# EAGLE schematic FLYTE_3.0 (EAGLE 9.6.2)
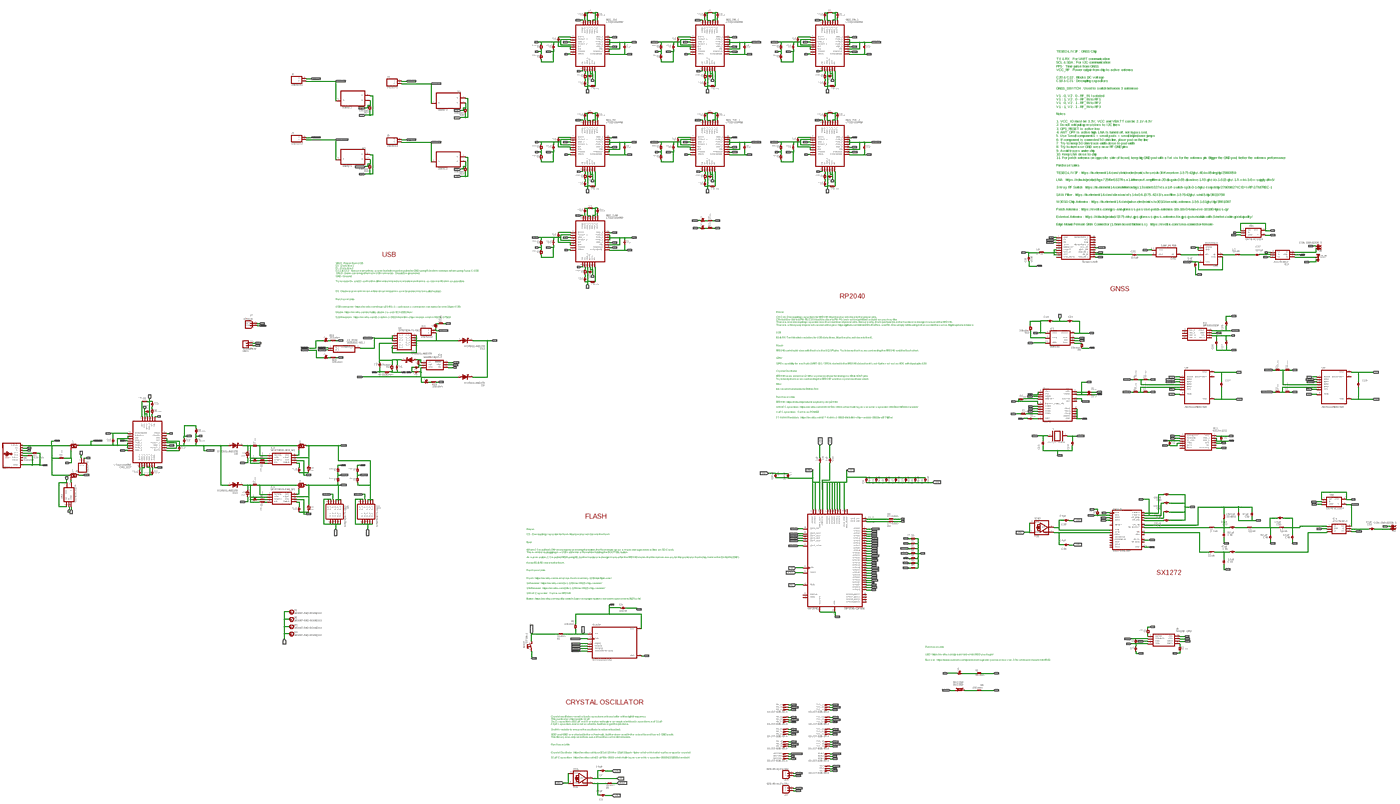
[diagram p0: schematic, sheet 1, overview]
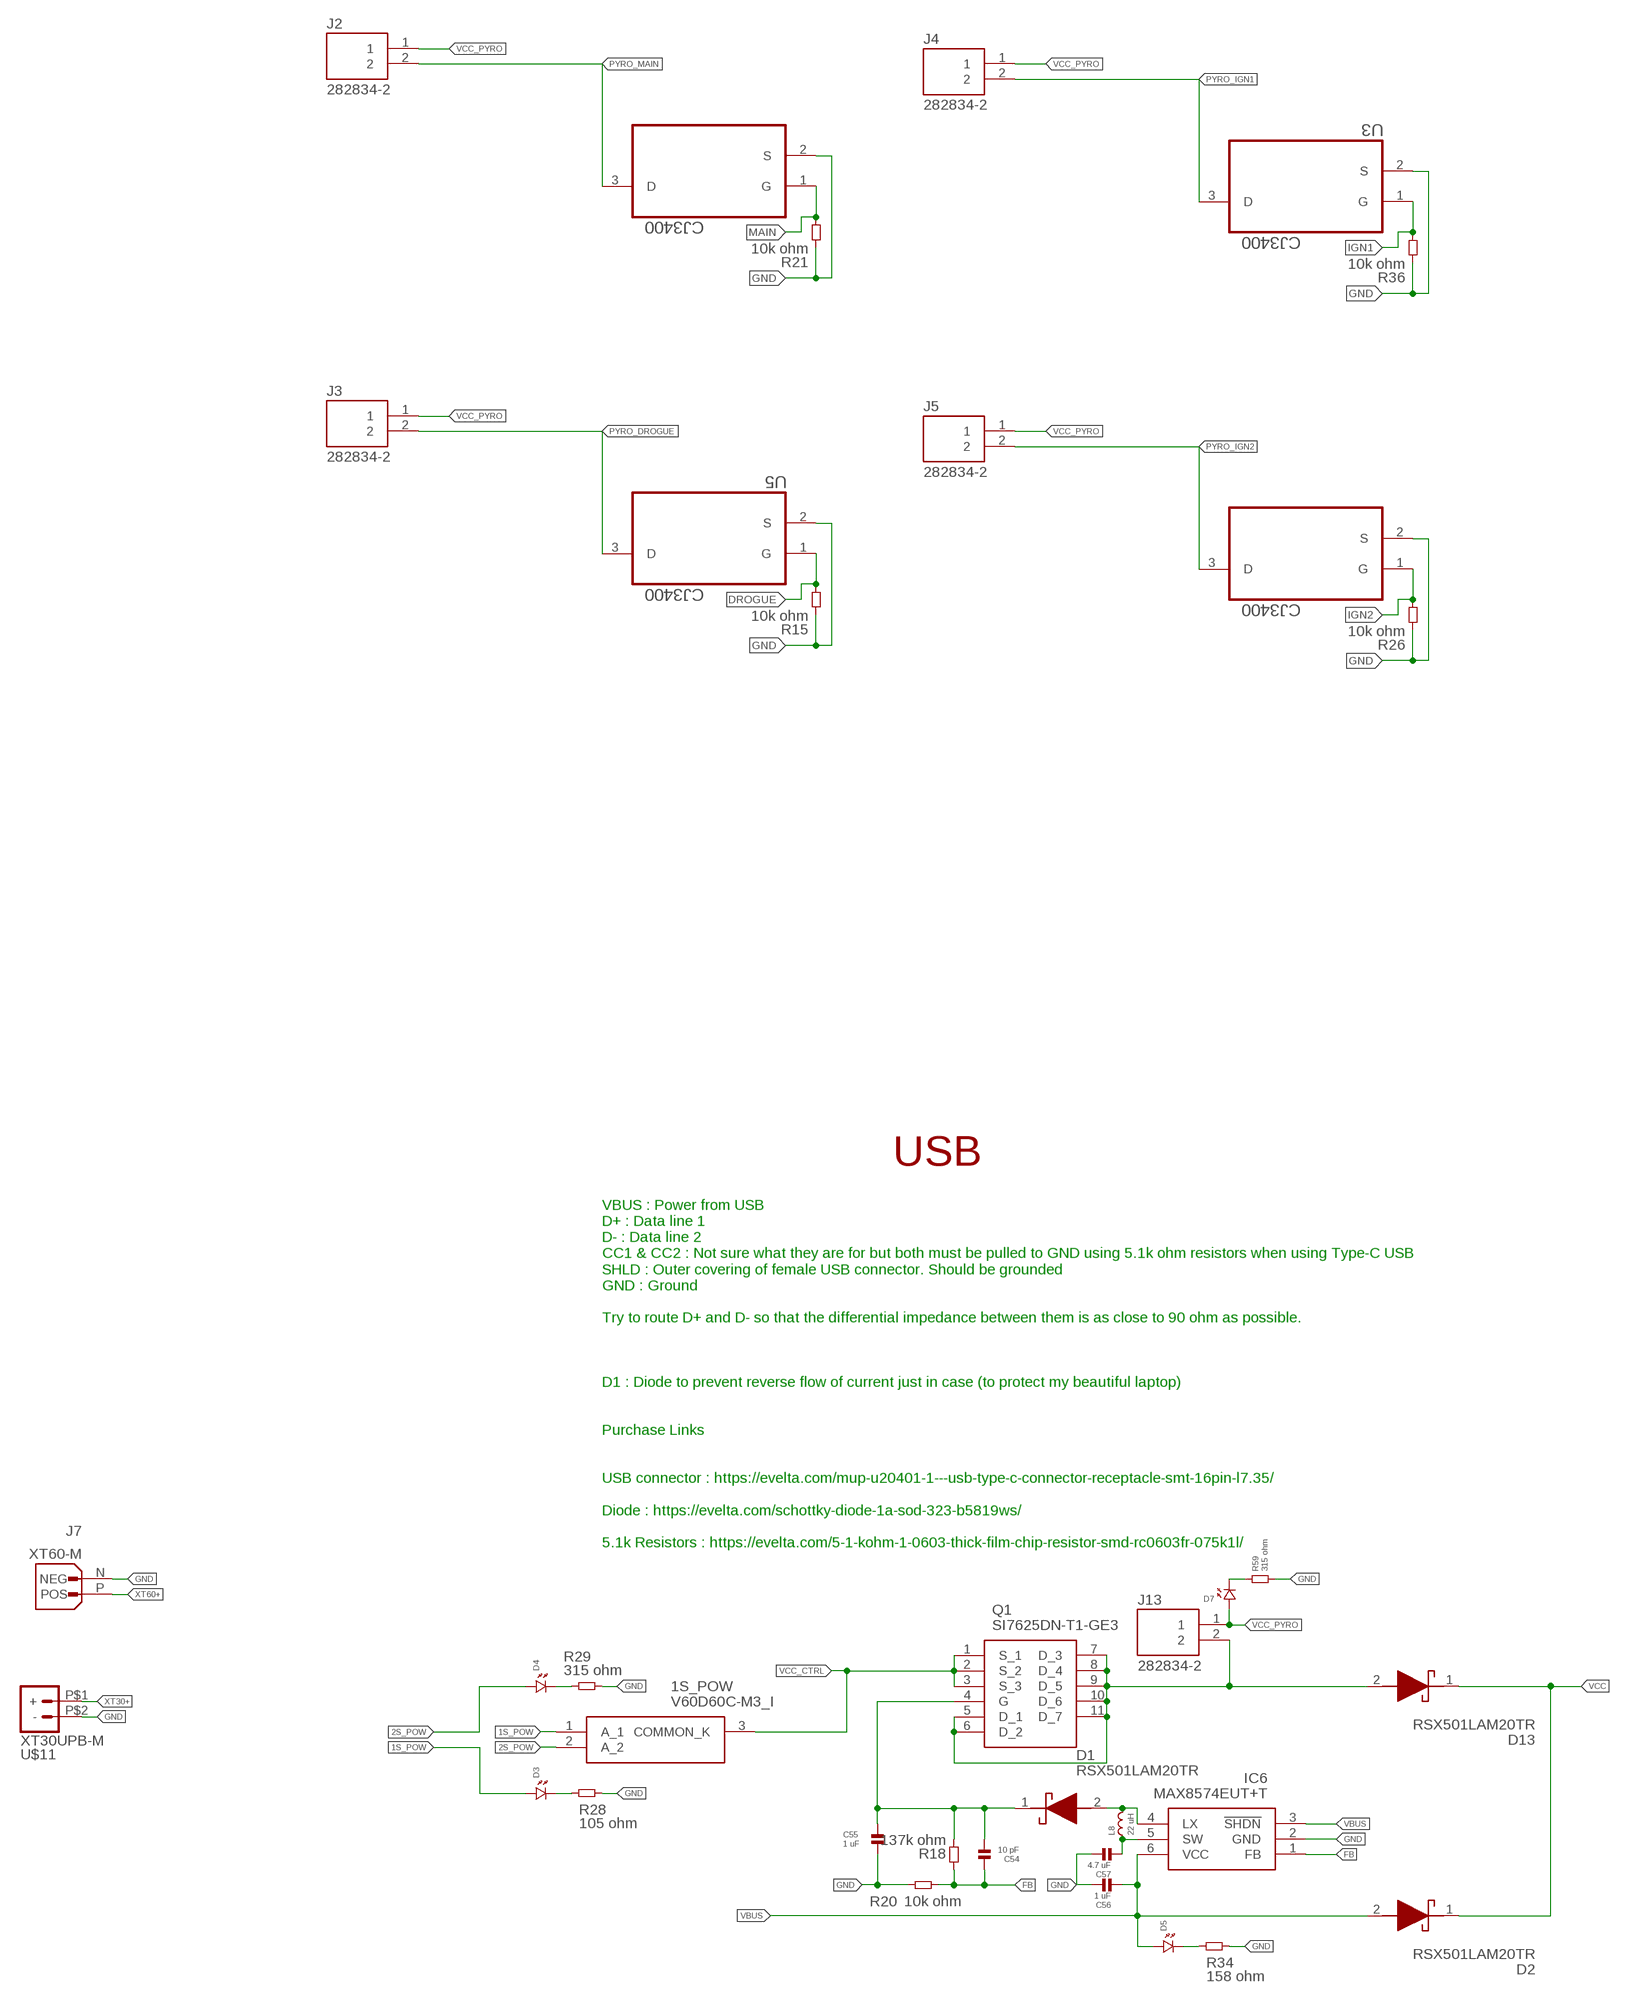
[diagram p1: schematic, sheet 1, part 1 of 6]
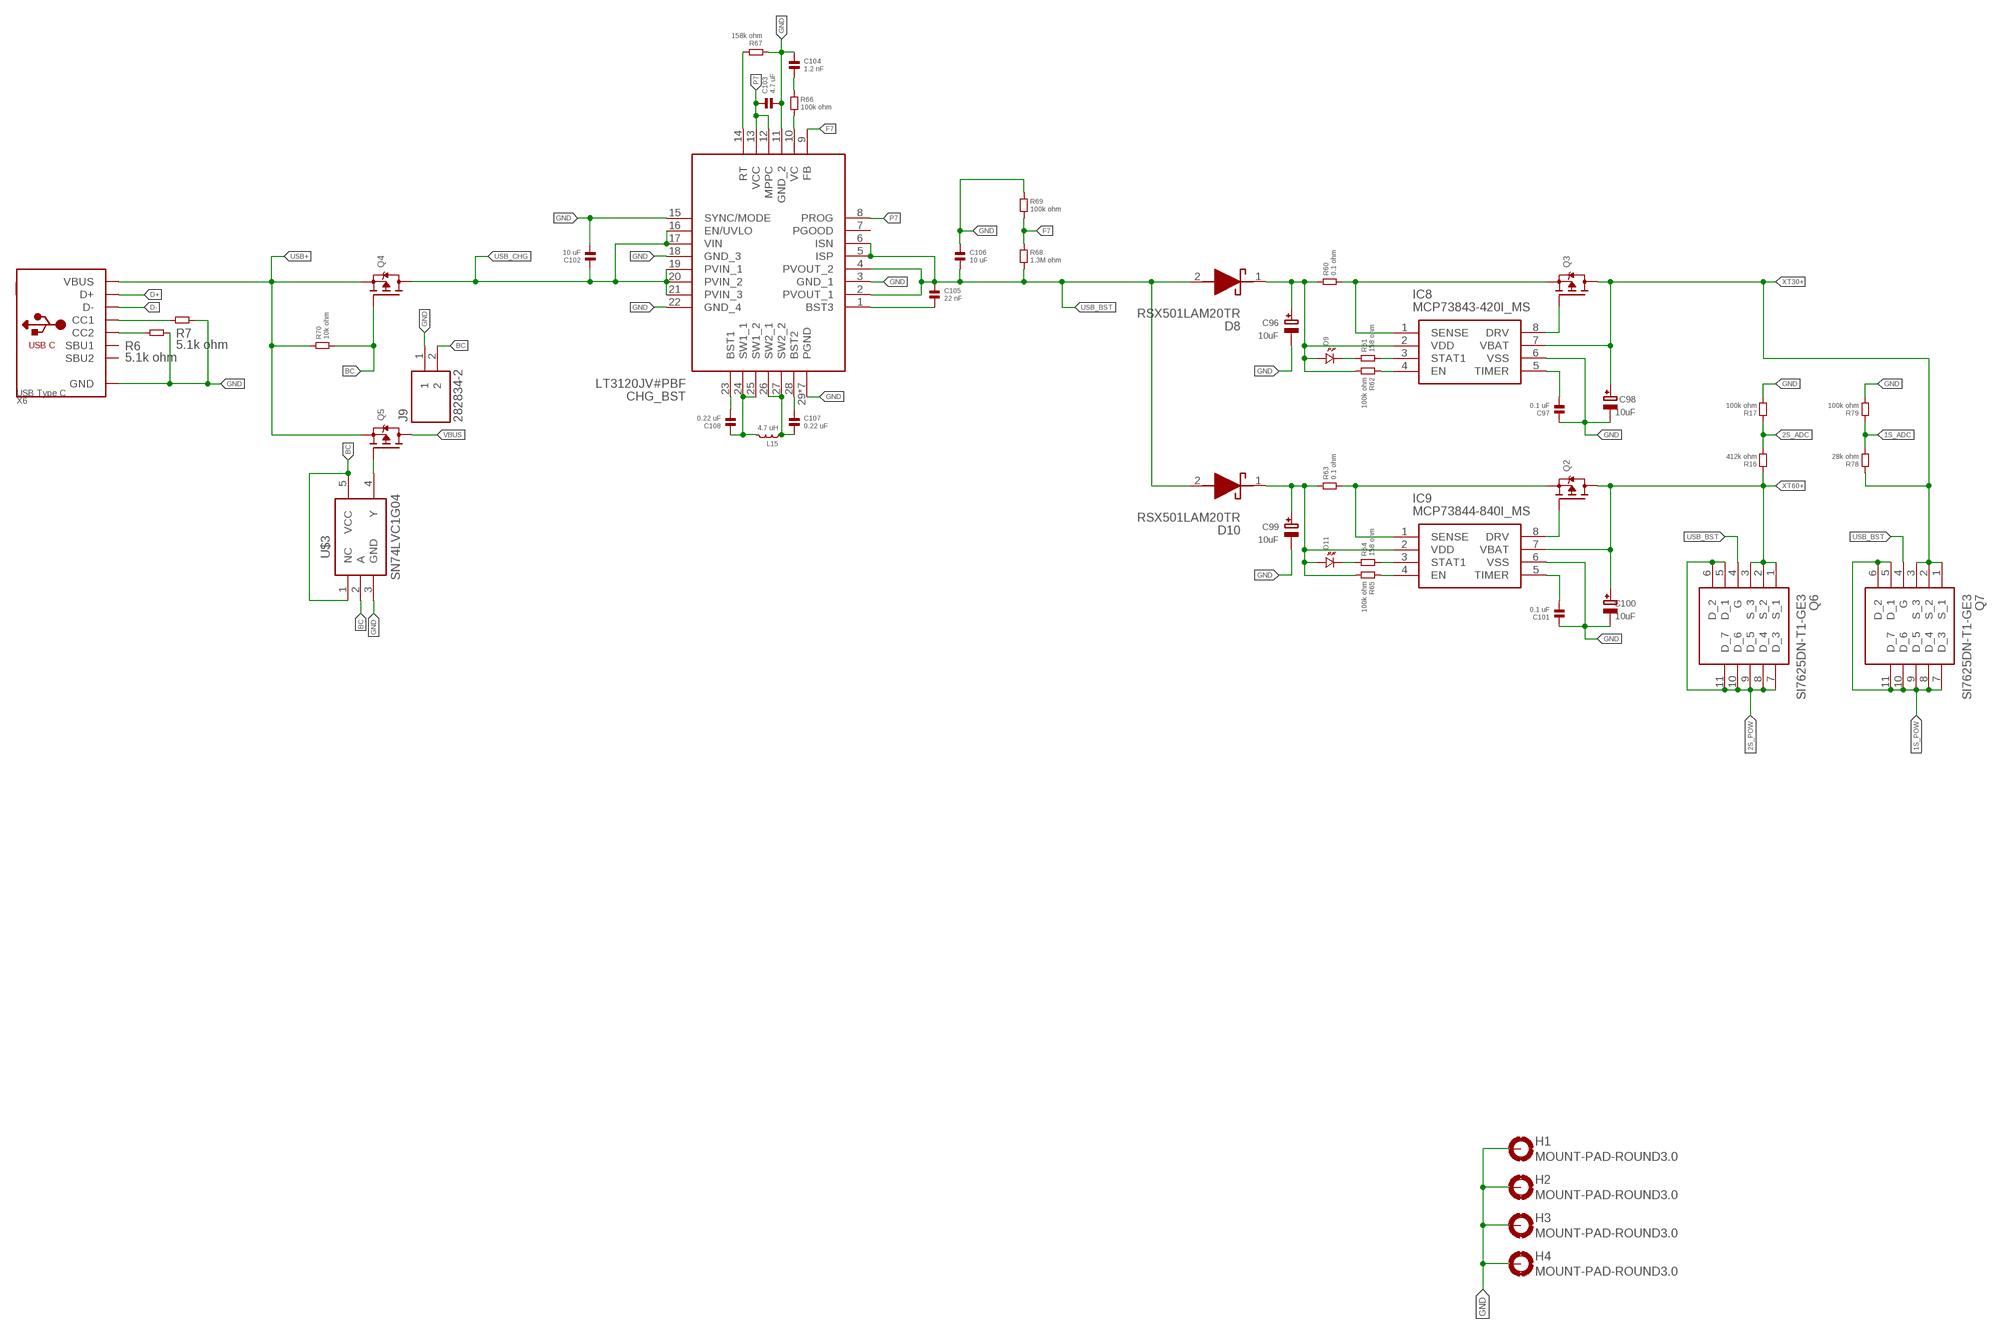
[diagram p2: schematic, sheet 1, part 2 of 6]
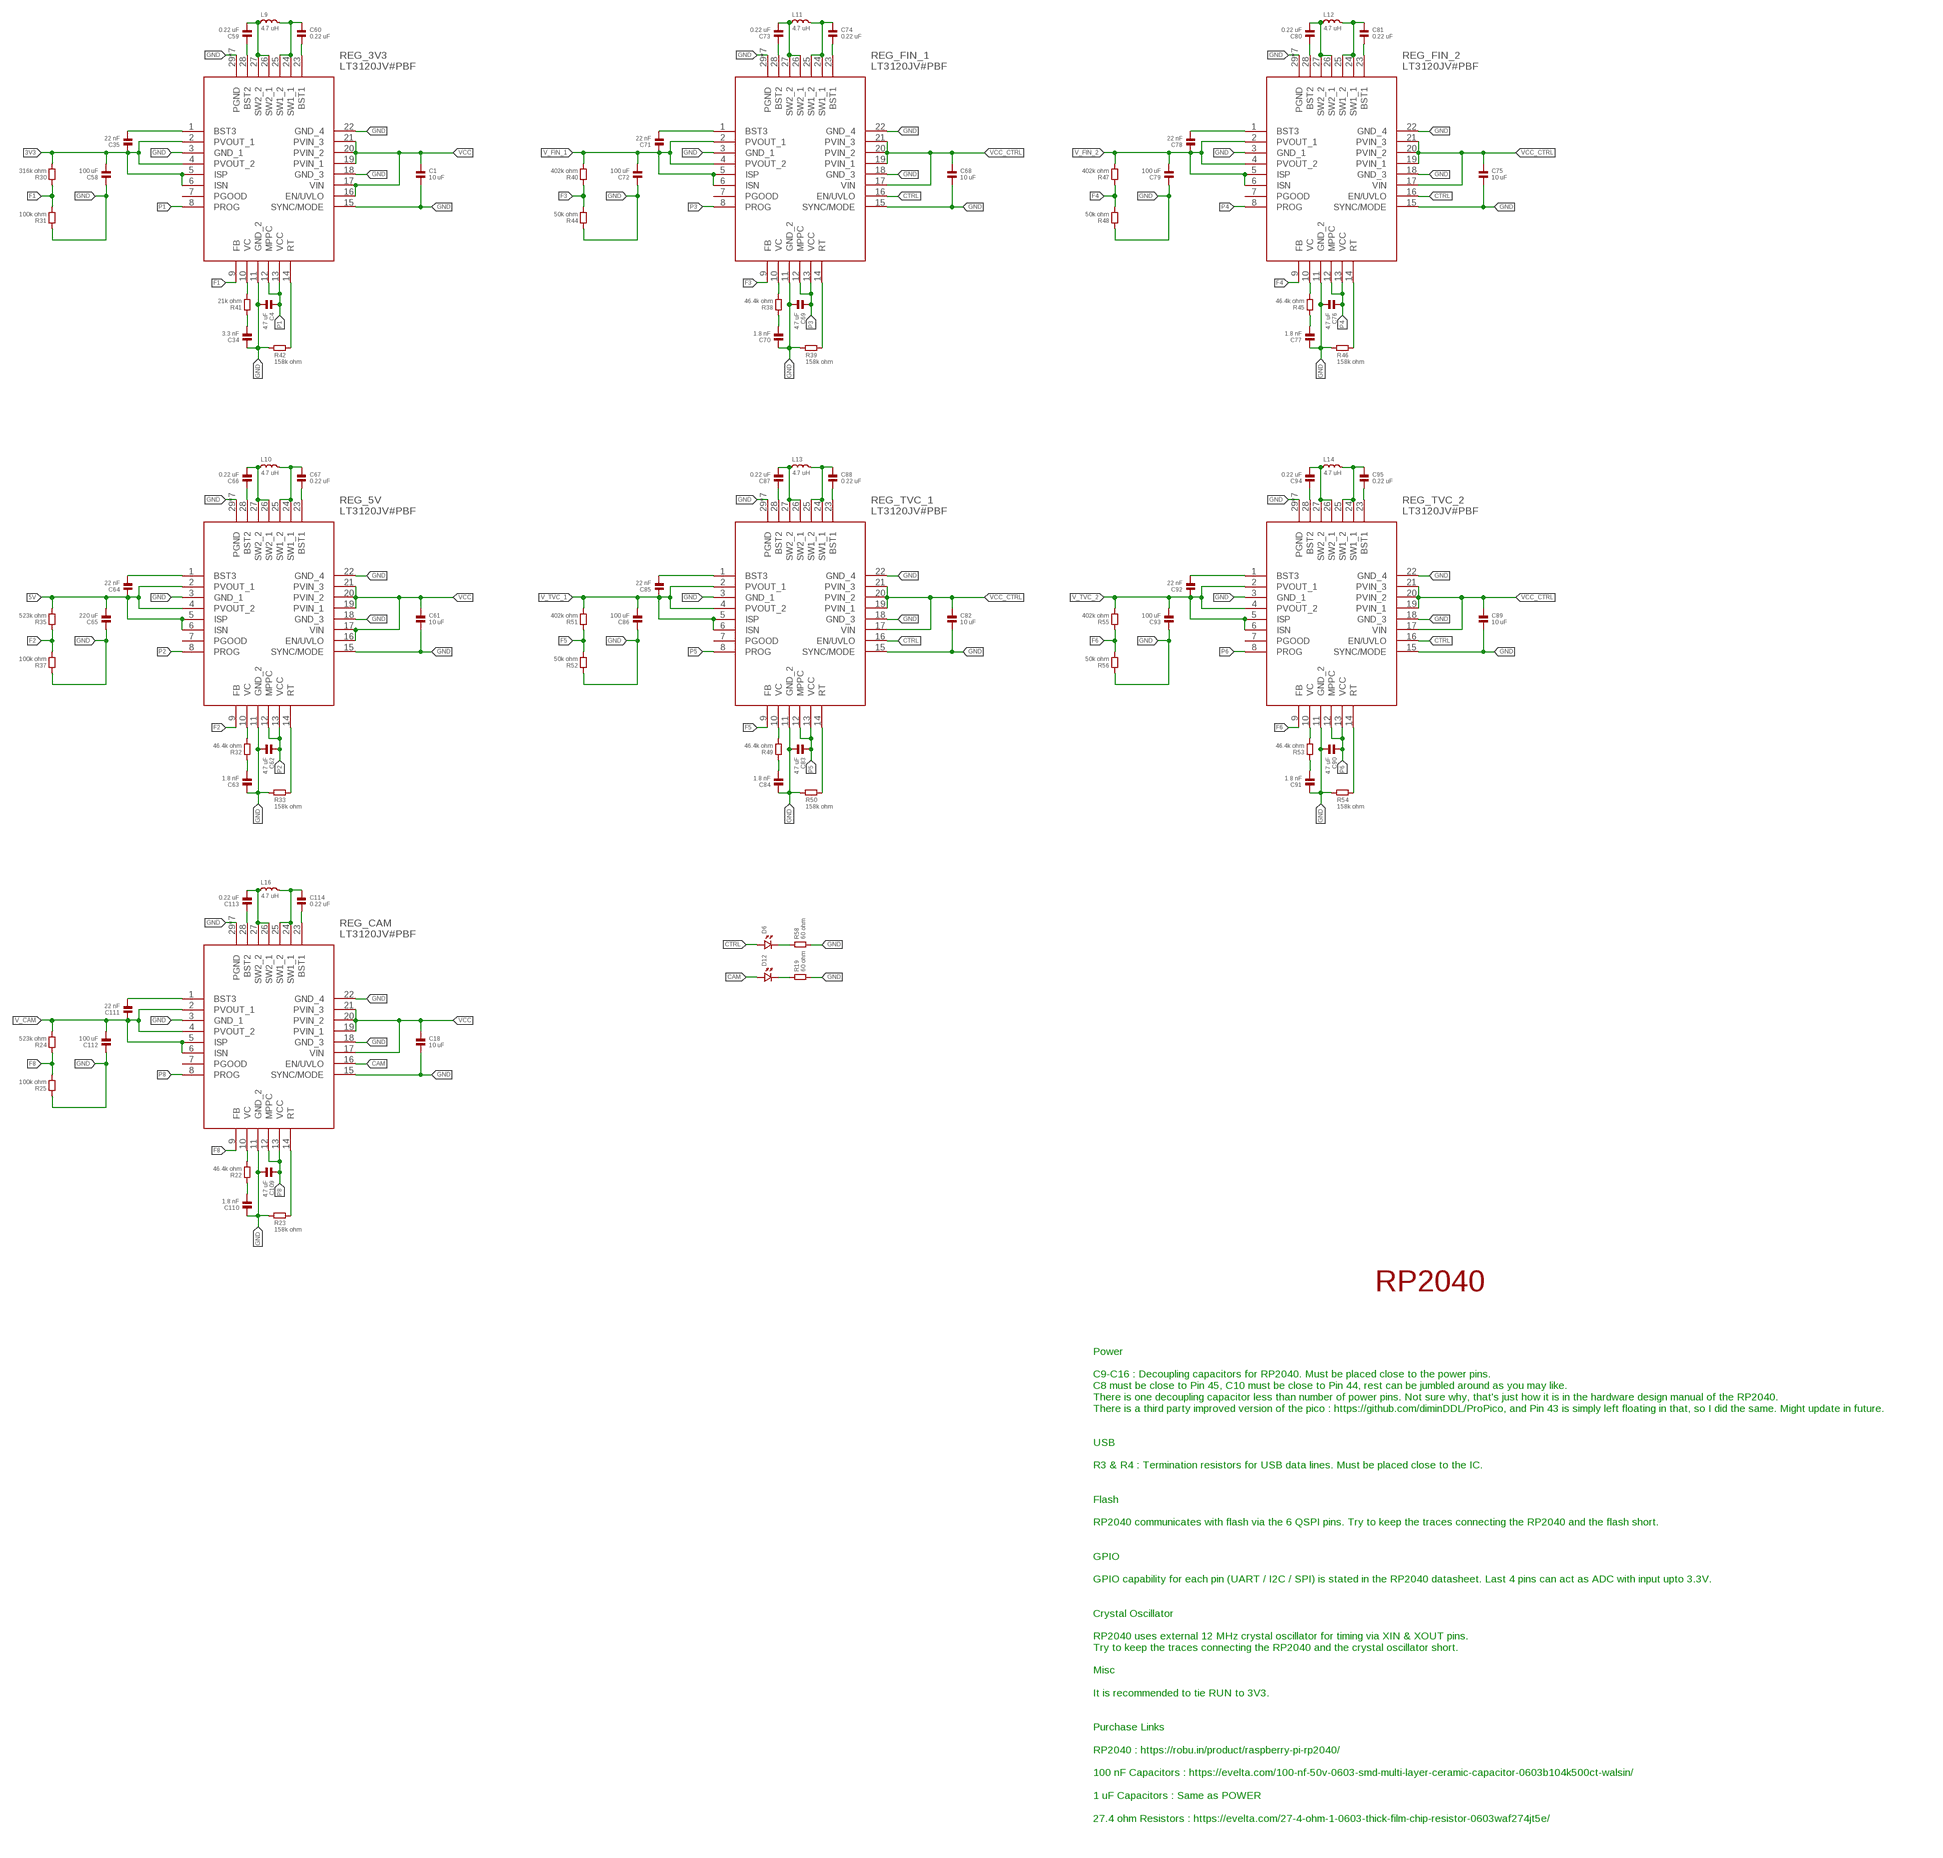
[diagram p3: schematic, sheet 1, part 3 of 6]
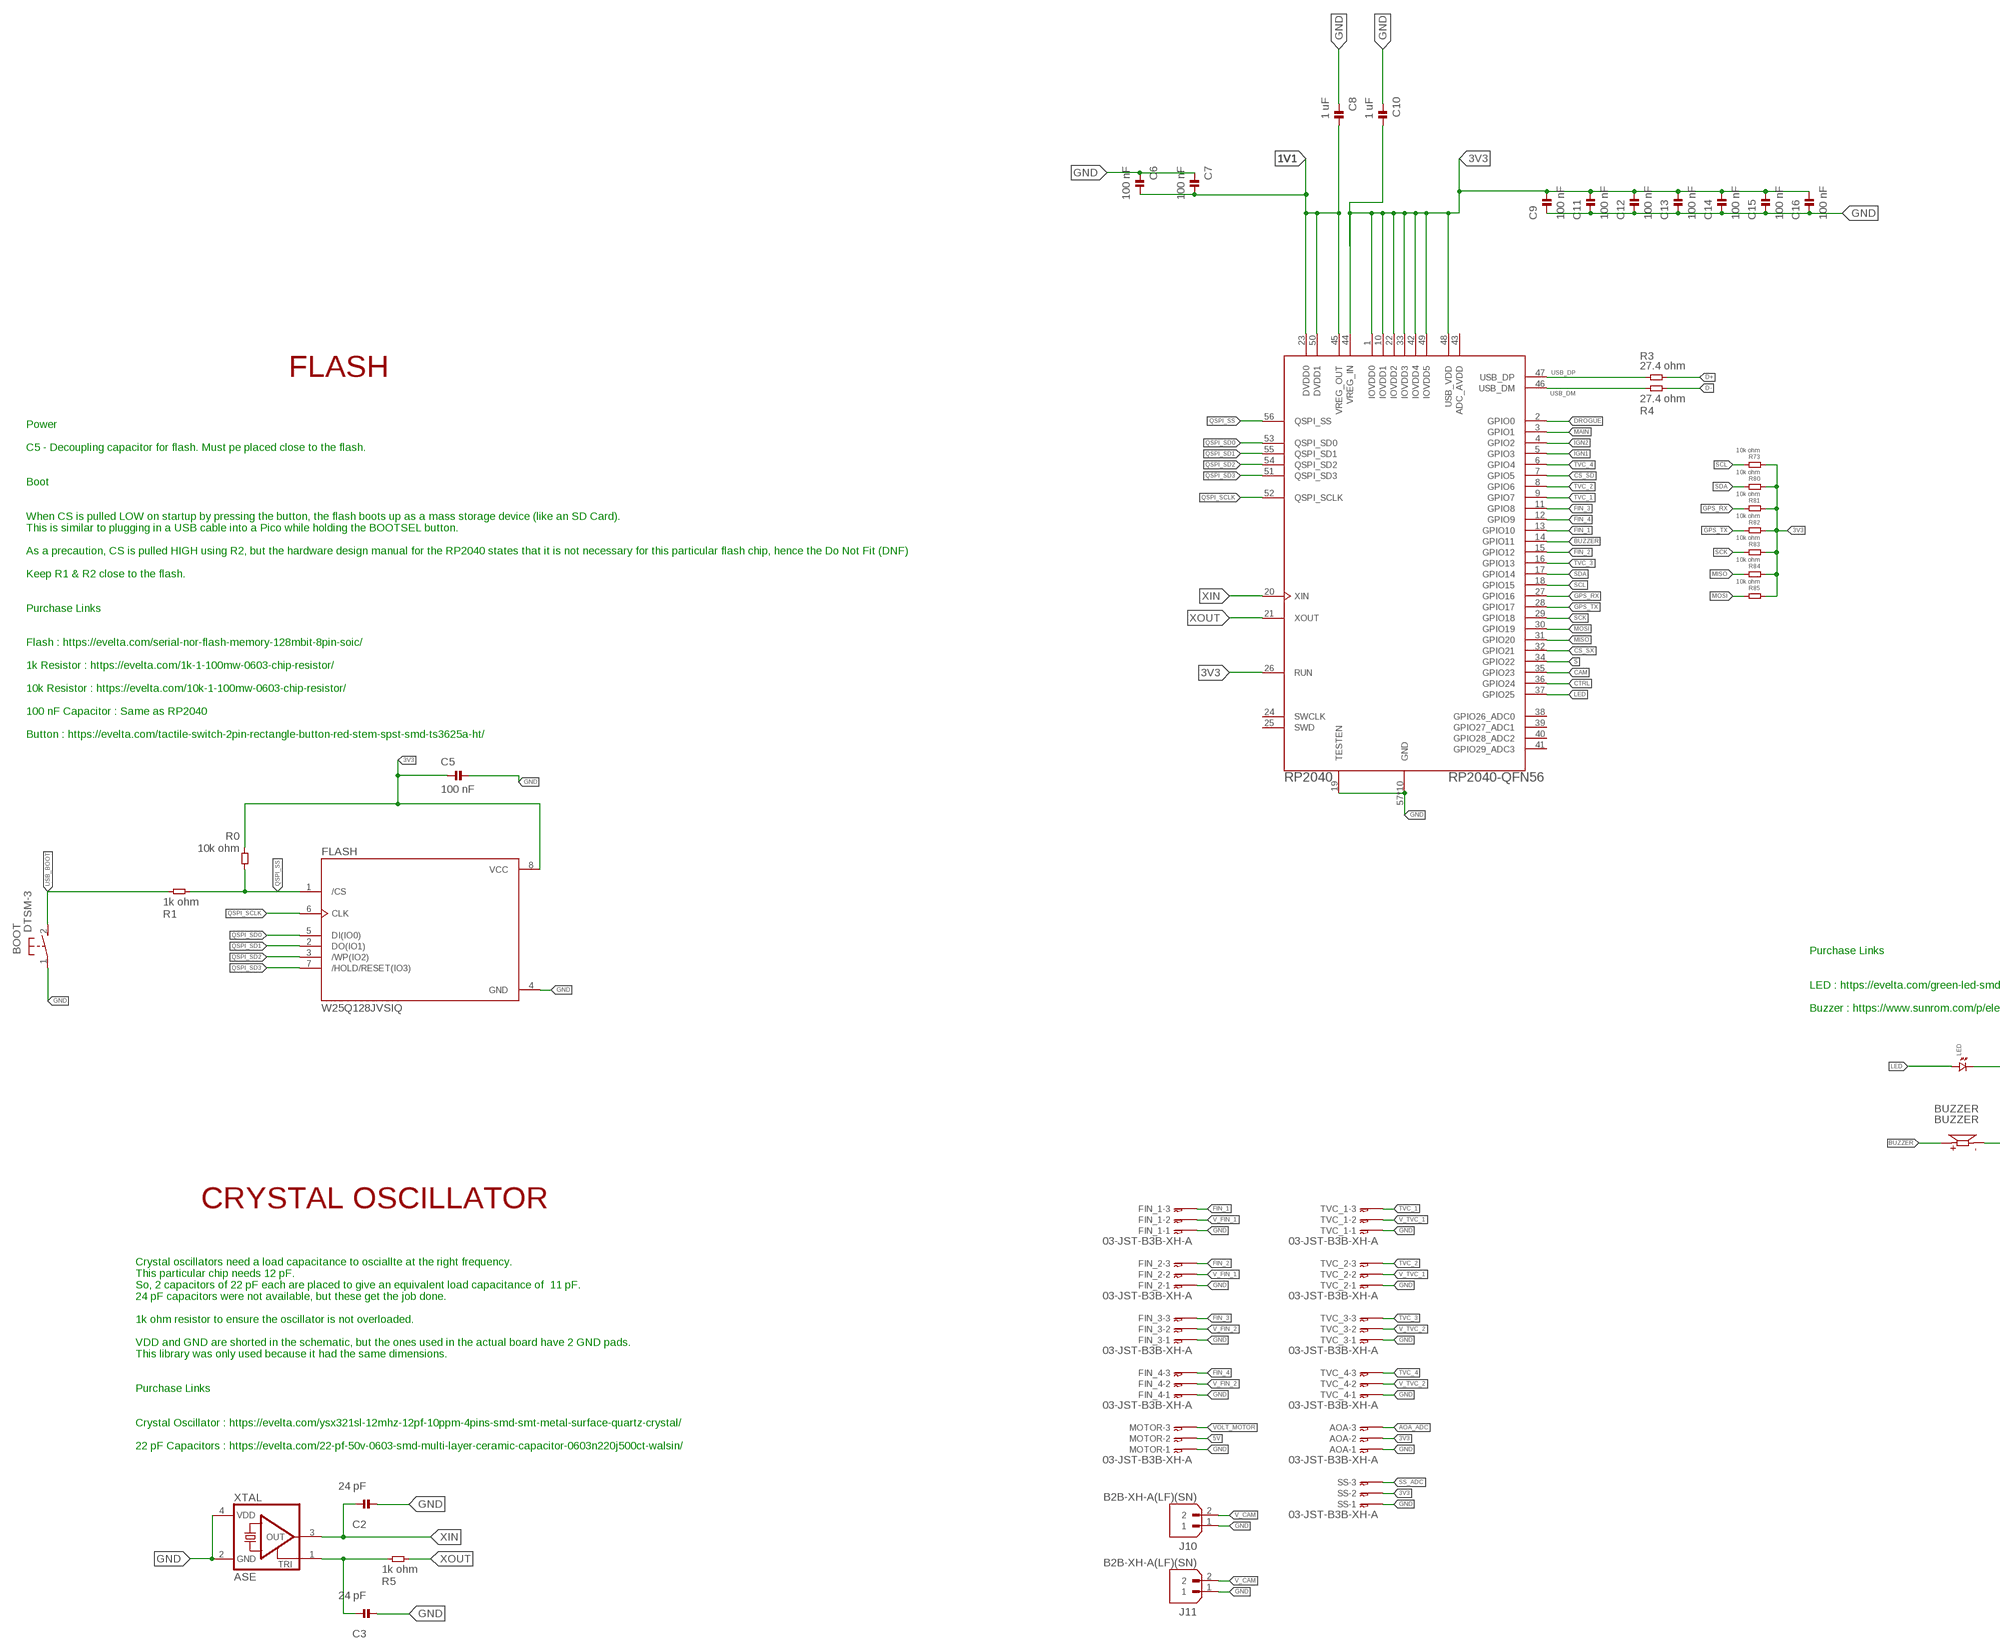
[diagram p4: schematic, sheet 1, part 4 of 6]
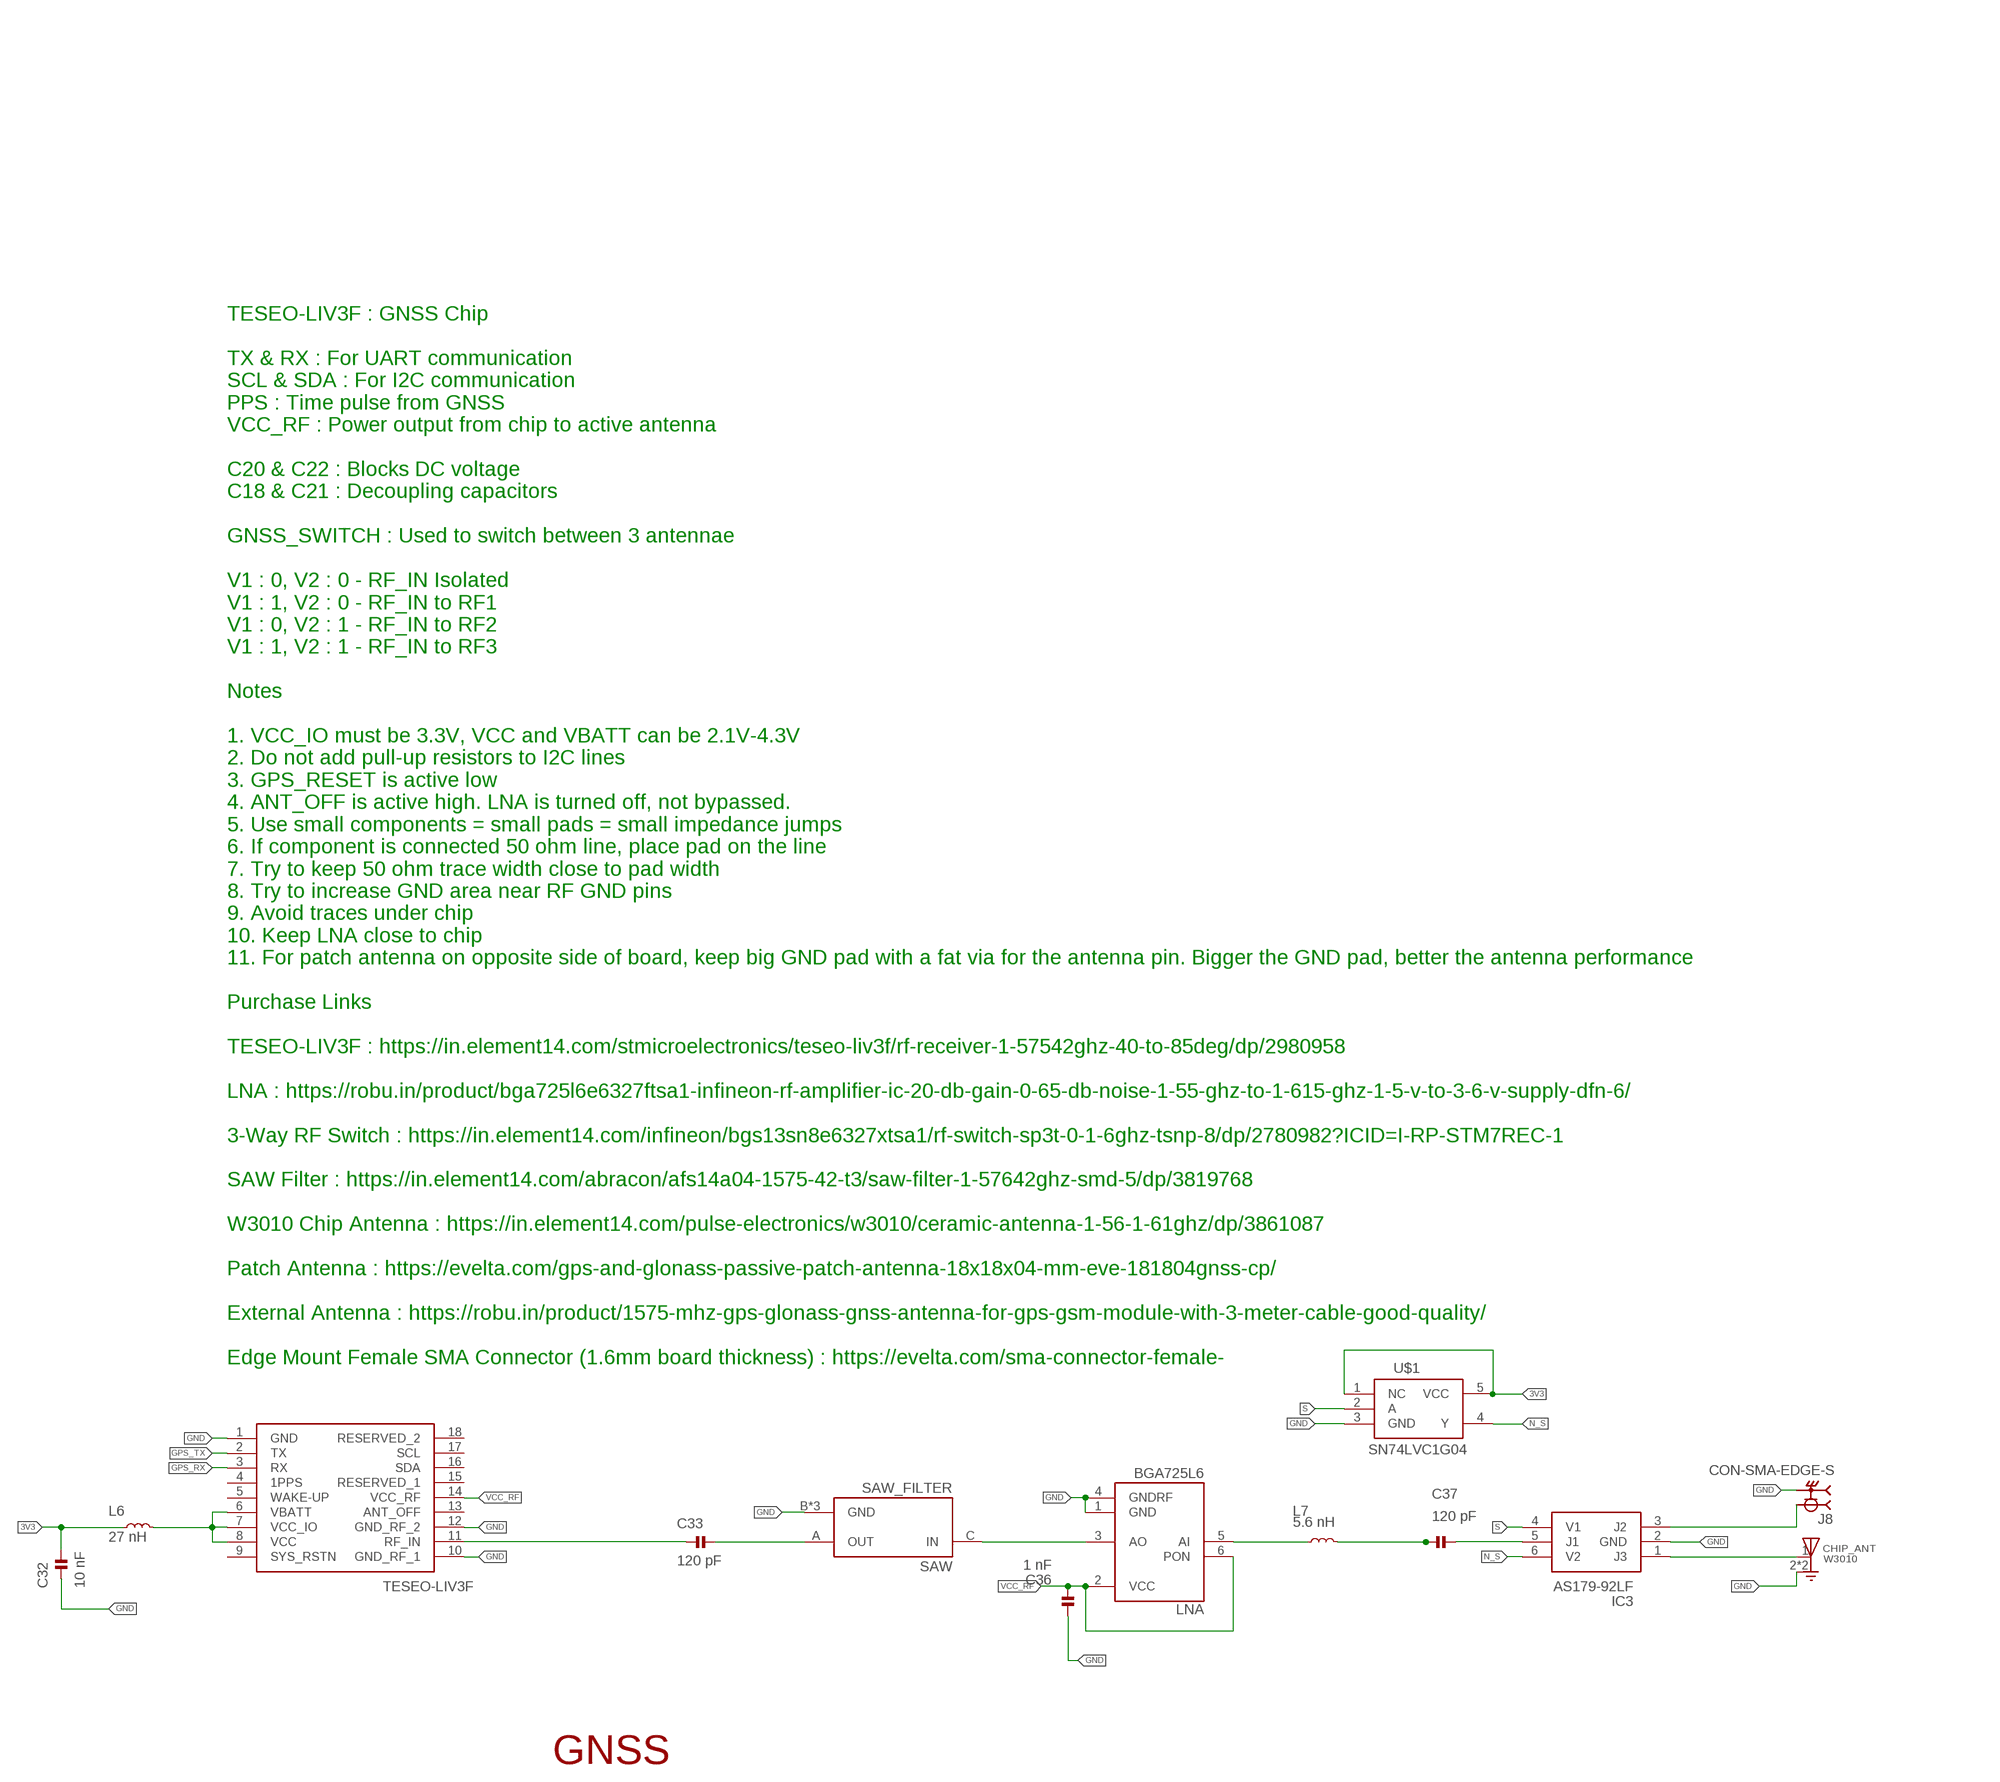
[diagram p5: schematic, sheet 1, part 5 of 6]
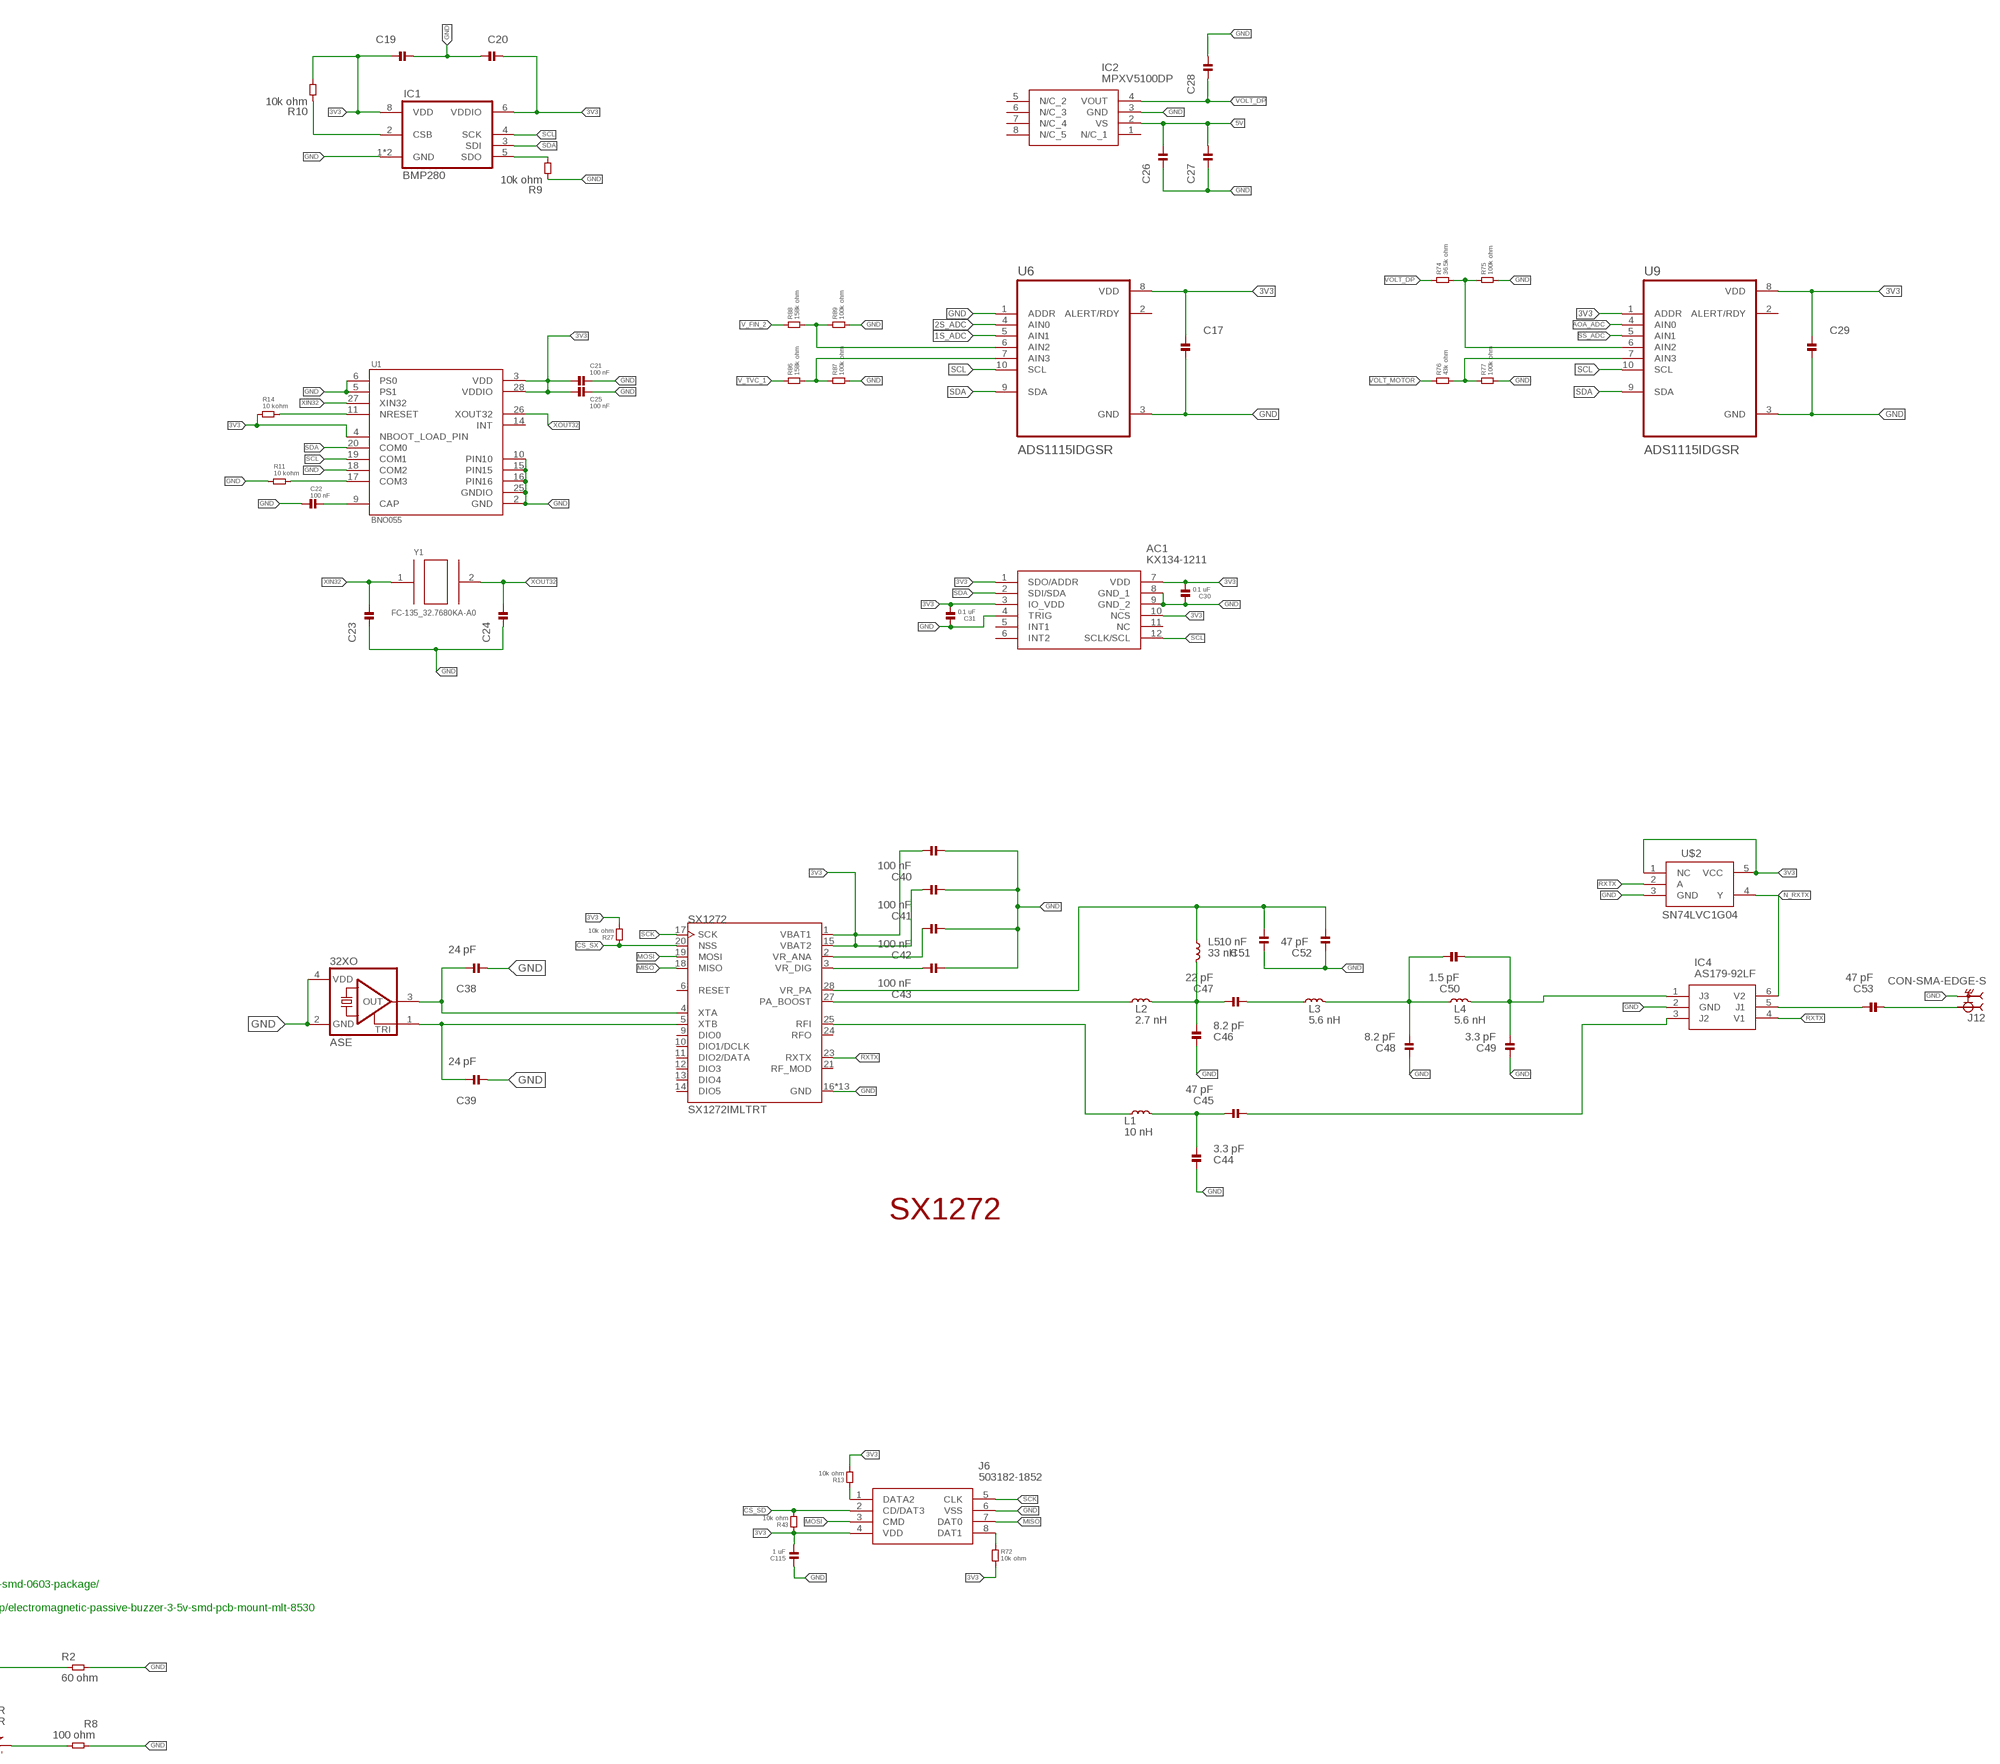
[diagram p6: schematic, sheet 1, part 6 of 6]

## Parts
1S_POW  V60D60C-M3_I  [V60D60CM3I]
32XO  ASE  [ASE]
AC1  KX134-1211  [KX1341211]
AOA  03-JST-B3B-XH-A  [B3B-XH]
BOOT  DTSM-3  [DTSM-3]
BUZZER  BUZZER  CMT-8530S-SMT  [CUI_CMT-8530S-SMT]
C1  10 uF  CAPACITOR.0603  [0603]
C2  24 pF  CAPACITOR.0603  [0603]
C3  24 pF  CAPACITOR.0603  [0603]
C4  4.7 uF  CAPACITOR.0603  [0603]
C5  100 nF  CAPACITOR.0603  [0603]
C6  100 nF  CAPACITOR.0603  [0603]
C7  100 nF  CAPACITOR.0603  [0603]
C8  1 uF  CAPACITOR.0603  [0603]
C9  100 nF  CAPACITOR.0603  [0603]
C10  1 uF  CAPACITOR.0603  [0603]
C11  100 nF  CAPACITOR.0603  [0603]
C12  100 nF  CAPACITOR.0603  [0603]
C13  100 nF  CAPACITOR.0603  [0603]
C14  100 nF  CAPACITOR.0603  [0603]
C15  100 nF  CAPACITOR.0603  [0603]
C16  100 nF  CAPACITOR.0603  [0603]
C17  0.1 uF  CAPACITOR.0603  [0603]
C18  10 uF  CAPACITOR.0603  [0603]
C19  100 nF  CAPACITOR.0603  [0603]
C20  100 nF  CAPACITOR.0603  [0603]
C21  100 nF  CAPACITOR.0603  [0603]
C22  100 nF  CAPACITOR.0603  [0603]
C23  25 pF  CAPACITOR.0603  [0603]
C24  25 pF  CAPACITOR.0603  [0603]
C25  100 nF  CAPACITOR.0603  [0603]
C26  1 uF  CAPACITOR.0603  [0603]
C27  10 nF  CAPACITOR.0603  [0603]
C28  470 pF  CAPACITOR.0603  [0603]
C29  0.1 uF  CAPACITOR.0603  [0603]
C30  0.1 uF  CAPACITOR.0603  [0603]
C31  0.1 uF  CAPACITOR.0603  [0603]
C32  10 nF  CAPACITOR.0603  [0603]
C33  120 pF  CAPACITOR.0603  [0603]
C34  3.3 nF  CAPACITOR.0603  [0603]
C35  22 nF  CAPACITOR.0603  [0603]
C36  1 nF  CAPACITOR.0603  [0603]
C37  120 pF  CAPACITOR.0603  [0603]
C38  24 pF  CAPACITOR.0603  [0603]
C39  24 pF  CAPACITOR.0603  [0603]
C40  100 nF  CAPACITOR.0603  [0603]
C41  100 nF  CAPACITOR.0603  [0603]
C42  100 nF  CAPACITOR.0603  [0603]
C43  100 nF  CAPACITOR.0603  [0603]
C44  3.3 pF  CAPACITOR.0603  [0603]
C45  47 pF  CAPACITOR.0603  [0603]
C46  8.2 pF  CAPACITOR.0603  [0603]
C47  22 pF  CAPACITOR.0603  [0603]
C48  8.2 pF  CAPACITOR.0603  [0603]
C49  3.3 pF  CAPACITOR.0603  [0603]
C50  1.5 pF  CAPACITOR.0603  [0603]
C51  10 nF  CAPACITOR.0603  [0603]
C52  47 pF  CAPACITOR.0603  [0603]
C53  47 pF  CAPACITOR.0603  [0603]
C54  10 pF  CAPACITOR.0603  [0603]
C55  1 uF  CAPACITOR.0603  [0603]
C56  1 uF  CAPACITOR.0603  [0603]
C57  4.7 uF  CAPACITOR.0603  [0603]
C58  100 uF  CAPACITOR.0805  [0805]
C59  0.22 uF  CAPACITOR.0603  [0603]
C60  0.22 uF  CAPACITOR.0603  [0603]
C61  10 uF  CAPACITOR.0603  [0603]
C62  4.7 uF  CAPACITOR.0603  [0603]
C63  1.8 nF  CAPACITOR.0603  [0603]
C64  22 nF  CAPACITOR.0603  [0603]
C65  220 uF  CAPACITOR.1210  [1210]
C66  0.22 uF  CAPACITOR.0603  [0603]
C67  0.22 uF  CAPACITOR.0603  [0603]
C68  10 uF  CAPACITOR.0603  [0603]
C69  4.7 uF  CAPACITOR.0603  [0603]
C70  1.8 nF  CAPACITOR.0603  [0603]
C71  22 nF  CAPACITOR.0603  [0603]
C72  100 uF  CAPACITOR.1206  [1206]
C73  0.22 uF  CAPACITOR.0603  [0603]
C74  0.22 uF  CAPACITOR.0603  [0603]
C75  10 uF  CAPACITOR.0603  [0603]
C76  4.7 uF  CAPACITOR.0603  [0603]
C77  1.8 nF  CAPACITOR.0603  [0603]
C78  22 nF  CAPACITOR.0603  [0603]
C79  100 uF  CAPACITOR.1206  [1206]
C80  0.22 uF  CAPACITOR.0603  [0603]
C81  0.22 uF  CAPACITOR.0603  [0603]
C82  10 uF  CAPACITOR.0603  [0603]
C83  4.7 uF  CAPACITOR.0603  [0603]
C84  1.8 nF  CAPACITOR.0603  [0603]
C85  22 nF  CAPACITOR.0603  [0603]
C86  100 uF  CAPACITOR.1206  [1206]
C87  0.22 uF  CAPACITOR.0603  [0603]
C88  0.22 uF  CAPACITOR.0603  [0603]
C89  10 uF  CAPACITOR.0603  [0603]
C90  4.7 uF  CAPACITOR.0603  [0603]
C91  1.8 nF  CAPACITOR.0603  [0603]
C92  22 nF  CAPACITOR.0603  [0603]
C93  100 uF  CAPACITOR.1206  [1206]
C94  0.22 uF  CAPACITOR.0603  [0603]
C95  0.22 uF  CAPACITOR.0603  [0603]
C96  10uF  CAP_TANTALUMA/3216_WAVE  [EIA3216-18/A-W]
C97  0.1 uF  CAPACITOR.0603  [0603]
C98  10uF  CAP_TANTALUMA/3216_WAVE  [EIA3216-18/A-W]
C99  10uF  CAP_TANTALUMA/3216_WAVE  [EIA3216-18/A-W]
C100  10uF  CAP_TANTALUMA/3216_WAVE  [EIA3216-18/A-W]
C101  0.1 uF  CAPACITOR.0603  [0603]
C102  10 uF  CAPACITOR.0603  [0603]
C103  4.7 uF  CAPACITOR.0603  [0603]
C104  1.2 nF  CAPACITOR.0603  [0603]
C105  22 nF  CAPACITOR.0603  [0603]
C106  10 uF  CAPACITOR.0603  [0603]
C107  0.22 uF  CAPACITOR.0603  [0603]
C108  0.22 uF  CAPACITOR.0603  [0603]
C109  4.7 uF  CAPACITOR.0603  [0603]
C110  1.8 nF  CAPACITOR.0603  [0603]
C111  22 nF  CAPACITOR.0603  [0603]
C112  100 uF  CAPACITOR.1210  [1210]
C113  0.22 uF  CAPACITOR.0603  [0603]
C114  0.22 uF  CAPACITOR.0603  [0603]
C115  1 uF  CAPACITOR.0603  [0603]
CHG_BST  LT3120JV#PBF  [QFN50P400X500X83-29N]
CHIP_ANT  W3010  [XCVR_W3010]
D1  RSX501LAM20TR  [SODFL4725X105N]
D2  RSX501LAM20TR  [SODFL4725X105N]
D3  LED.0603  [0603.LED]
D4  LED.0603  [0603.LED]
D5  LED.0603  [0603.LED]
D6  LED.0603  [0603.LED]
D7  LED.0603  [0603.LED]
D8  RSX501LAM20TR  [SODFL4725X105N]
D9  LED.0603  [0603.LED]
D10  RSX501LAM20TR  [SODFL4725X105N]
D11  LED.0603  [0603.LED]
D12  LED.0603  [0603.LED]
D13  RSX501LAM20TR  [SODFL4725X105N]
FIN_1  03-JST-B3B-XH-A  [B3B-XH]
FIN_2  03-JST-B3B-XH-A  [B3B-XH]
FIN_3  03-JST-B3B-XH-A  [B3B-XH]
FIN_4  03-JST-B3B-XH-A  [B3B-XH]
FLASH  W25Q128JVSIQ  [SOIC127P790X216-8N]
GNSS  TESEO-LIV3F  [SON110P970X1010X230-18N]
H1  MOUNT-PAD-ROUND3.0  [3,0-PAD]
H2  MOUNT-PAD-ROUND3.0  [3,0-PAD]
H3  MOUNT-PAD-ROUND3.0  [3,0-PAD]
H4  MOUNT-PAD-ROUND3.0  [3,0-PAD]
IC1  BMP280  [BMP280]
IC2  MPXV5100DP  [MPXV5100DP]
IC3  AS179-92LF  [SOT65P220X100-6N]
IC4  AS179-92LF  [SOT65P220X100-6N]
IC6  MAX8574EUT+T  [SOT95P280X145-6N]
IC8  MCP73843-420I_MS  [SOP65P490X110-8N]
IC9  MCP73844-840I_MS  MCP73843-420I_MS  [SOP65P490X110-8N]
J2  282834-2  [TE_282834-2]
J3  282834-2  [TE_282834-2]
J4  282834-2  [TE_282834-2]
J5  282834-2  [TE_282834-2]
J6  503182-1852  [5031821852]
J7  XT60-M  [AMASS_XT60-M]
J8  CON-SMA-EDGE-S  [RFSOLUTIONS_CON-SMA-EDGE-S]
J9  282834-2  [TE_282834-2]
J10  B2B-XH-A(LF)(SN)  [JST_B2B-XH-A(LF)(SN)]
J11  B2B-XH-A(LF)(SN)  [JST_B2B-XH-A(LF)(SN)]
J12  CON-SMA-EDGE-S  [RFSOLUTIONS_CON-SMA-EDGE-S]
J13  282834-2  [TE_282834-2]
L1  10 nH  RF-INDUCTOR.0603  [0603]
L2  2.7 nH  RF-INDUCTOR.0603  [0603]
L3  5.6 nH  RF-INDUCTOR.0603  [0603]
L4  5.6 nH  RF-INDUCTOR.0603  [0603]
L5  33 nH  RF-INDUCTOR.0603  [0603]
L6  27 nH  RF-INDUCTOR.0603  [0603]
L7  5.6 nH  RF-INDUCTOR.0603  [0603]
L8  22 uH  RF-INDUCTOR.0603  [0603]
L9  4.7 uH  RF-INDUCTOR.0603  [0603]
L10  4.7 uH  RF-INDUCTOR.0603  [0603]
L11  4.7 uH  RF-INDUCTOR.0603  [0603]
L12  4.7 uH  RF-INDUCTOR.0603  [0603]
L13  4.7 uH  RF-INDUCTOR.0603  [0603]
L14  4.7 uH  RF-INDUCTOR.0603  [0603]
L15  4.7 uH  RF-INDUCTOR.0603  [0603]
L16  4.7 uH  RF-INDUCTOR.0603  [0603]
LED  LED.0603  [0603.LED]
LNA  BGA725L6  BGA725L6E6327FTSA1  [AMP_BGA725L6E6327FTSA1]
MOTOR  03-JST-B3B-XH-A  [B3B-XH]
Q1  SI7625DN-T1-GE3  [SIS862DNT1GE3]
Q2  MOSFET-PWIDE  [SOT23-WIDE]
Q3  MOSFET-PWIDE  [SOT23-WIDE]
Q4  MOSFET-PWIDE  [SOT23-WIDE]
Q5  MOSFET-PWIDE  [SOT23-WIDE]
Q6  SI7625DN-T1-GE3  [SIS862DNT1GE3]
Q7  SI7625DN-T1-GE3  [SIS862DNT1GE3]
R0  10k ohm  RESISTOR.0603  [0603]
R1  1k ohm  RESISTOR.0603  [0603]
R2  60 ohm  RESISTOR.0603  [0603]
R3  27.4 ohm  RESISTOR.0603  [0603]
R4  27.4 ohm  RESISTOR.0603  [0603]
R5  1k ohm  RESISTOR.0603  [0603]
R6  5.1k ohm  RESISTOR.0603  [0603]
R7  5.1k ohm  RESISTOR.0603  [0603]
R8  100 ohm  RESISTOR.0603  [0603]
R9  10k ohm  RESISTOR.0603  [0603]
R10  10k ohm  RESISTOR.0603  [0603]
R11  10 kohm  RESISTOR.0603  [0603]
R13  10k ohm  RESISTOR.0603  [0603]
R14  10 kohm  RESISTOR.0603  [0603]
R15  10k ohm  RESISTOR.0603  [0603]
R16  412k ohm  RESISTOR.0603  [0603]
R17  100k ohm  RESISTOR.0603  [0603]
R18  137k ohm  RESISTOR.0603  [0603]
R19  60 ohm  RESISTOR.0603  [0603]
R20  10k ohm  RESISTOR.0603  [0603]
R21  10k ohm  RESISTOR.0603  [0603]
R22  46.4k ohm  RESISTOR.0603  [0603]
R23  158k ohm  RESISTOR.0603  [0603]
R24  523k ohm  RESISTOR.0603  [0603]
R25  100k ohm  RESISTOR.0603  [0603]
R26  10k ohm  RESISTOR.0603  [0603]
R27  10k ohm  RESISTOR.0603  [0603]
R28  105 ohm  RESISTOR.0603  [0603]
R29  315 ohm  RESISTOR.0603  [0603]
R30  316k ohm  RESISTOR.0603  [0603]
R31  100k ohm  RESISTOR.0603  [0603]
R32  46.4k ohm  RESISTOR.0603  [0603]
R33  158k ohm  RESISTOR.0603  [0603]
R34  158 ohm  RESISTOR.0603  [0603]
R35  523k ohm  RESISTOR.0603  [0603]
R36  10k ohm  RESISTOR.0603  [0603]
R37  100k ohm  RESISTOR.0603  [0603]
R38  46.4k ohm  RESISTOR.0603  [0603]
R39  158k ohm  RESISTOR.0603  [0603]
R40  402k ohm  RESISTOR.0603  [0603]
R41  21k ohm  RESISTOR.0603  [0603]
R42  158k ohm  RESISTOR.0603  [0603]
R43  10k ohm  RESISTOR.0603  [0603]
R44  50k ohm  RESISTOR.0603  [0603]
R45  46.4k ohm  RESISTOR.0603  [0603]
R46  158k ohm  RESISTOR.0603  [0603]
R47  402k ohm  RESISTOR.0603  [0603]
R48  50k ohm  RESISTOR.0603  [0603]
R49  46.4k ohm  RESISTOR.0603  [0603]
R50  158k ohm  RESISTOR.0603  [0603]
R51  402k ohm  RESISTOR.0603  [0603]
R52  50k ohm  RESISTOR.0603  [0603]
R53  46.4k ohm  RESISTOR.0603  [0603]
R54  158k ohm  RESISTOR.0603  [0603]
R55  402k ohm  RESISTOR.0603  [0603]
R56  50k ohm  RESISTOR.0603  [0603]
R58  60 ohm  RESISTOR.0603  [0603]
R59  315 ohm  RESISTOR.0603  [0603]
R60  0.1 ohm  RESISTOR.0603  [0603]
R61  158 ohm  RESISTOR.0603  [0603]
R62  100k ohm  RESISTOR.0603  [0603]
R63  0.1 ohm  RESISTOR.0603  [0603]
R64  158 ohm  RESISTOR.0603  [0603]
R65  100k ohm  RESISTOR.0603  [0603]
R66  100k ohm  RESISTOR.0603  [0603]
R67  158k ohm  RESISTOR.0603  [0603]
R68  1.3M ohm  RESISTOR.0603  [0603]
R69  100k ohm  RESISTOR.0603  [0603]
R70  10k ohm  RESISTOR.0603  [0603]
R72  10k ohm  RESISTOR.0603  [0603]
R73  10k ohm  RESISTOR.0603  [0603]
R74  36.5k ohm  RESISTOR.0603  [0603]
R75  100k ohm  RESISTOR.0603  [0603]
R76  43k ohm  RESISTOR.0603  [0603]
R77  100k ohm  RESISTOR.0603  [0603]
R78  28k ohm  RESISTOR.0603  [0603]
R79  100k ohm  RESISTOR.0603  [0603]
R80  10k ohm  RESISTOR.0603  [0603]
R81  10k ohm  RESISTOR.0603  [0603]
R82  10k ohm  RESISTOR.0603  [0603]
R83  10k ohm  RESISTOR.0603  [0603]
R84  10k ohm  RESISTOR.0603  [0603]
R85  10k ohm  RESISTOR.0603  [0603]
R86  158k ohm  RESISTOR.0603  [0603]
R87  100k ohm  RESISTOR.0603  [0603]
R88  158k ohm  RESISTOR.0603  [0603]
R89  100k ohm  RESISTOR.0603  [0603]
REG_3V3  LT3120JV#PBF  [QFN50P400X500X83-29N]
REG_5V  LT3120JV#PBF  [QFN50P400X500X83-29N]
REG_CAM  LT3120JV#PBF  [QFN50P400X500X83-29N]
REG_FIN_1  LT3120JV#PBF  [QFN50P400X500X83-29N]
REG_FIN_2  LT3120JV#PBF  [QFN50P400X500X83-29N]
REG_TVC_1  LT3120JV#PBF  [QFN50P400X500X83-29N]
REG_TVC_2  LT3120JV#PBF  [QFN50P400X500X83-29N]
RP2040  RP2040-QFN56  [RP2040-QFN-56]
SAW  SAW_FILTER  AFS14A04-1575.42-T3  [FIL_AFS14A04-1575.42-T3]
SS  03-JST-B3B-XH-A  [B3B-XH]
SX1272  SX1272IMLTRT  [QFN65P600X600X100-29N]
TVC_1  03-JST-B3B-XH-A  [B3B-XH]
TVC_2  03-JST-B3B-XH-A  [B3B-XH]
TVC_3  03-JST-B3B-XH-A  [B3B-XH]
TVC_4  03-JST-B3B-XH-A  [B3B-XH]
U1  BNO055  [LGA28R50P4X10_380X520X100]
U2  CJ3400  BS170F  [SOT91P240X120-3N]
U3  CJ3400  BS170F  [SOT91P240X120-3N]
U5  CJ3400  BS170F  [SOT91P240X120-3N]
U6  ADS1115IDGSR  [SOP50P490X110-10N]
U7  CJ3400  BS170F  [SOT91P240X120-3N]
U9  ADS1115IDGSR  [SOP50P490X110-10N]
U$1  SN74LVC1G04DBVR  [SOT23-5]
U$2  SN74LVC1G04DBVR  [SOT23-5]
U$3  SN74LVC1G04DBVR  [SOT23-5]
U$11  XT30UPB-M  [XT30UPB-M]
X6  USB Type C  USB_C  [USB_C_CUSB31-CFM2AX-01-X]
XTAL  ASE  [ASE]
Y1  FC-135_32.7680KA-A0  [XTAL_FC-135_32.7680KA-A0]

## Nets
1S_ADC: R78.2 R79.1 U6.5(AIN1)
1S_POW: 1S_POW.1(A_1) D3.P$1 Q7.5(D_1) Q7.6(D_2) Q7.7(D_3) Q7.8(D_4) Q7.9(D_5) Q7.10(D_6) Q7.11(D_7)
1V1: C6.2 C7.2 C8.2 RP2040.23(DVDD0) RP2040.45(VREG_OUT) RP2040.50(DVDD1)
2S_ADC: R16.2 R17.1 U6.4(AIN0)
2S_POW: 1S_POW.2(A_2) D4.P$1 Q6.5(D_1) Q6.6(D_2) Q6.7(D_3) Q6.8(D_4) Q6.9(D_5) Q6.10(D_6) Q6.11(D_7)
3V3: AC1.1(SDO/ADDR) AC1.3(IO_VDD) AC1.7(VDD) AC1.10(NCS) AOA.P$2 C5.1 C9.2 C10.2 C11.2 C12.2 C13.2 C14.2 C15.2 C16.2 C17.1 C19.2 C20.1 C21.1 C25.1 C29.1 C30.2 C31.2 C32.2 C35.1 C40.2 C41.2 C58.2 C115.2 FLASH.8(VCC) IC1.6(VDDIO) IC1.8(VDD) J6.4(VDD) L6.1 R0.2 R10.2 R13.2 R14.1 R27.2 R30.2 R43.1 R72.2 R73.2 R80.2 R81.2 R82.2 R83.2 R84.2 R85.2 REG_3V3.2(PVOUT_1) REG_3V3.4(PVOUT_2) REG_3V3.5(ISP) REG_3V3.6(ISN) RP2040.1(IOVDD0) RP2040.10(IOVDD1) RP2040.22(IOVDD2) RP2040.26(RUN) RP2040.33(IOVDD3) RP2040.42(IOVDD4) RP2040.44(VREG_IN) RP2040.48(USB_VDD) RP2040.49(IOVDD5) SS.P$2 SX1272.1(VBAT1) SX1272.15(VBAT2) U1.3(VDD) U1.4(NBOOT_LOAD_PIN) U1.28(VDDIO) U6.8(VDD) U9.1(ADDR) U9.8(VDD) U$1.1(NC) U$1.5(VCC) U$2.1(NC) U$2.5(VCC)
5V: C26.1 C27.1 C64.1 C65.2 IC2.2(VS) MOTOR.P$2 R35.2 REG_5V.2(PVOUT_1) REG_5V.4(PVOUT_2) REG_5V.5(ISP) REG_5V.6(ISN)
AIN2: R88.2 R89.1 U6.6(AIN2)
AIN3: R86.2 R87.1 U6.7(AIN3)
AOA_ADC: AOA.P$3 U9.4(AIN0)
BC: J9.2 Q4.1(G) R70.2 U$3.1(NC) U$3.2(A) U$3.5(VCC)
BUZZER: BUZZER.P RP2040.14(GPIO11)
CAM: D12.P$1 REG_CAM.16(EN/UVLO) RP2040.35(GPIO23)
CC1: R7.1 X6.A5(CC1)
CC2: R6.1 X6.B5(CC2)
CS_SD: J6.2(CD/DAT3) R43.2 RP2040.7(GPIO5)
CS_SX: R27.1 RP2040.32(GPIO21) SX1272.20(NSS)
CSB: IC1.2(CSB) R10.1
CTRL: D6.P$1 REG_FIN_1.16(EN/UVLO) REG_FIN_2.16(EN/UVLO) REG_TVC_1.16(EN/UVLO) REG_TVC_2.16(EN/UVLO) RP2040.36(GPIO24)
D+: R3.2 X6.A6(D+) X6.B6(D+)
D-: R4.2 X6.A7(D-) X6.B7(D-)
DROGUE: R15.2 RP2040.2(GPIO0) U5.1(G)
F1: R30.1 R31.2 REG_3V3.9(FB)
F2: R35.1 R37.2 REG_5V.9(FB)
F3: R40.1 R44.2 REG_FIN_1.9(FB)
F4: R47.1 R48.2 REG_FIN_2.9(FB)
F5: R51.1 R52.2 REG_TVC_1.9(FB)
F6: R55.1 R56.2 REG_TVC_2.9(FB)
F7: CHG_BST.9(FB) R68.1 R69.2
F8: R24.1 R25.2 REG_CAM.9(FB)
FB: C54.1 IC6.1(FB) R18.1 R20.1
FIN_1: FIN_1.P$3 RP2040.13(GPIO10)
FIN_2: FIN_2.P$3 RP2040.15(GPIO12)
FIN_3: FIN_3.P$3 RP2040.11(GPIO8)
FIN_4: FIN_4.P$3 RP2040.12(GPIO9)
GND: 32XO.2(GND) 32XO.4(VDD) AC1.4(TRIG) AC1.8(GND_1) AC1.9(GND_2) AOA.P$1 BOOT.1 C1.2 C2.1 C3.1 C4.2 C5.2 C6.1 C7.1 C8.1 C9.1 C10.1 C11.1 C12.1 C13.1 C14.1 C15.1 C16.1 C17.2 C18.2 C19.1 C20.2 C21.2 C22.1 C23.2 C24.2 C25.2 C26.2 C27.2 C28.1 C29.2 C30.1 C31.1 C32.1 C34.1 C36.1 C38.1 C39.1 C40.1 C41.1 C42.1 C43.1 C44.2 C46.2 C48.2 C49.2 C51.2 C52.2 C55.2 C56.2 C57.2 C58.1 C61.2 C62.2 C63.1 C65.1 C68.2 C69.2 C70.1 C72.1 C75.2 C76.2 C77.1 C79.1 C82.2 C83.2 C84.1 C86.1 C89.2 C90.2 C91.1 C93.1 C96.- C97.1 C98.- C99.- C100.- C101.1 C102.2 C103.2 C104.1 C106.1 C109.2 C110.1 C112.1 C115.1 CHG_BST.3(GND_1) CHG_BST.11(GND_2) CHG_BST.15(SYNC/MODE) CHG_BST.18(GND_3) CHG_BST.22(GND_4) CHG_BST.29(PGND) CHG_BST.P$1(PGND) CHG_BST.P$2(PGND) CHG_BST.P$3(PGND) CHG_BST.P$4(PGND) CHG_BST.P$5(PGND) CHG_BST.P$6(PGND) CHIP_ANT.2(GND) CHIP_ANT.3(GND) FIN_1.P$1 FIN_2.P$1 FIN_3.P$1 FIN_4.P$1 FLASH.4(GND) GNSS.1(GND) GNSS.10(GND_RF_1) GNSS.12(GND_RF_2) H1.B3,0(MOUNT) H2.B3,0(MOUNT) H3.B3,0(MOUNT) H4.B3,0(MOUNT) IC1.1(GND) IC1.7(GND) IC2.3(GND) IC3.2(GND) IC4.2(GND) IC6.2(GND) IC8.6(VSS) IC9.6(VSS) J6.6(VSS) J7.N(NEG) J8.G1 J8.G2 J8.G3 J8.G4 J9.1 J10.1 J11.1 J12.G1 J12.G2 J12.G3 J12.G4 LNA.1(GND) LNA.4(GNDRF) MOTOR.P$1 R2.2 R6.2 R7.2 R8.2 R9.1 R11.1 R15.1 R17.2 R19.2 R20.2 R21.1 R23.1 R25.1 R26.1 R28.1 R29.1 R31.1 R33.1 R34.1 R36.1 R37.1 R39.1 R42.1 R44.1 R46.1 R48.1 R50.1 R52.1 R54.1 R56.1 R58.2 R59.2 R67.1 R69.1 R75.2 R77.2 R79.2 R87.2 R89.2 REG_3V3.3(GND_1) REG_3V3.11(GND_2) REG_3V3.15(SYNC/MODE) REG_3V3.18(GND_3) REG_3V3.22(GND_4) REG_3V3.29(PGND) REG_3V3.P$1(PGND) REG_3V3.P$2(PGND) REG_3V3.P$3(PGND) REG_3V3.P$4(PGND) REG_3V3.P$5(PGND) REG_3V3.P$6(PGND) REG_5V.3(GND_1) REG_5V.11(GND_2) REG_5V.15(SYNC/MODE) REG_5V.18(GND_3) REG_5V.22(GND_4) REG_5V.29(PGND) REG_5V.P$1(PGND) REG_5V.P$2(PGND) REG_5V.P$3(PGND) REG_5V.P$4(PGND) REG_5V.P$5(PGND) REG_5V.P$6(PGND) REG_CAM.3(GND_1) REG_CAM.11(GND_2) REG_CAM.15(SYNC/MODE) REG_CAM.18(GND_3) REG_CAM.22(GND_4) REG_CAM.29(PGND) REG_CAM.P$1(PGND) REG_CAM.P$2(PGND) REG_CAM.P$3(PGND) REG_CAM.P$4(PGND) REG_CAM.P$5(PGND) REG_CAM.P$6(PGND) REG_FIN_1.3(GND_1) REG_FIN_1.11(GND_2) REG_FIN_1.15(SYNC/MODE) REG_FIN_1.18(GND_3) REG_FIN_1.22(GND_4) REG_FIN_1.29(PGND) REG_FIN_1.P$1(PGND) REG_FIN_1.P$2(PGND) REG_FIN_1.P$3(PGND) REG_FIN_1.P$4(PGND) REG_FIN_1.P$5(PGND) REG_FIN_1.P$6(PGND) REG_FIN_2.3(GND_1) REG_FIN_2.11(GND_2) REG_FIN_2.15(SYNC/MODE) REG_FIN_2.18(GND_3) REG_FIN_2.22(GND_4) REG_FIN_2.29(PGND) REG_FIN_2.P$1(PGND) REG_FIN_2.P$2(PGND) REG_FIN_2.P$3(PGND) REG_FIN_2.P$4(PGND) REG_FIN_2.P$5(PGND) REG_FIN_2.P$6(PGND) REG_TVC_1.3(GND_1) REG_TVC_1.11(GND_2) REG_TVC_1.15(SYNC/MODE) REG_TVC_1.18(GND_3) REG_TVC_1.22(GND_4) REG_TVC_1.29(PGND) REG_TVC_1.P$1(PGND) REG_TVC_1.P$2(PGND) REG_TVC_1.P$3(PGND) REG_TVC_1.P$4(PGND) REG_TVC_1.P$5(PGND) REG_TVC_1.P$6(PGND) REG_TVC_2.3(GND_1) REG_TVC_2.11(GND_2) REG_TVC_2.15(SYNC/MODE) REG_TVC_2.18(GND_3) REG_TVC_2.22(GND_4) REG_TVC_2.29(PGND) REG_TVC_2.P$1(PGND) REG_TVC_2.P$2(PGND) REG_TVC_2.P$3(PGND) REG_TVC_2.P$4(PGND) REG_TVC_2.P$5(PGND) REG_TVC_2.P$6(PGND) RP2040.19(TESTEN) RP2040.57(GND) RP2040.58(GND) RP2040.59(GND) RP2040.60(GND) RP2040.61(GND) RP2040.62(GND) RP2040.63(GND) RP2040.64(GND) RP2040.65(GND) RP2040.66(GND) SAW.B(GND) SAW.D(GND) SAW.E(GND) SS.P$1 SX1272.16(GND) SX1272.22(GND) SX1272.26(GND) SX1272.29(GND) SX1272.P$1(GND) SX1272.P$2(GND) SX1272.P$3(GND) SX1272.P$4(GND) SX1272.P$5(GND) SX1272.P$6(GND) SX1272.P$7(GND) SX1272.P$8(GND) SX1272.P$9(GND) TVC_1.P$1 TVC_2.P$1 TVC_3.P$1 TVC_4.P$1 U1.2(GND) U1.5(PS1) U1.6(PS0) U1.10(PIN10) U1.15(PIN15) U1.16(PIN16) U1.18(COM2) U1.25(GNDIO) U2.2(S) U3.2(S) U5.2(S) U6.1(ADDR) U6.3(GND) U7.2(S) U9.3(GND) U$1.3(GND) U$2.3(GND) U$3.3(GND) U$11.P$2(-) X6.A1B12(GND) X6.B1A12(GND) XTAL.2(GND) XTAL.4(VDD)
GPS_RX: GNSS.3(RX) R81.1 RP2040.27(GPIO16)
GPS_TX: GNSS.2(TX) R82.1 RP2040.28(GPIO17)
IGN1: R36.2 RP2040.5(GPIO3) U3.1(G)
IGN2: R26.2 RP2040.4(GPIO2) U2.1(G)
LED: LED.P$1 RP2040.37(GPIO25)
MAIN: R21.2 RP2040.3(GPIO1) U7.1(G)
MISO: J6.7(DAT0) R84.1 RP2040.31(GPIO20) SX1272.18(MISO)
MOS: D13.2(A) J13.2 Q1.5(D_1) Q1.6(D_2) Q1.7(D_3) Q1.8(D_4) Q1.9(D_5) Q1.10(D_6) Q1.11(D_7)
MOSI: J6.3(CMD) R85.1 RP2040.30(GPIO19) SX1272.19(MOSI)
N$1: D1.2(A) IC6.4(LX) L8.2
N$2: LED.P$2 R2.1
N$3: C3.2 R5.1 XTAL.1(TRI)
N$4: C33.1 GNSS.11(RF_IN)
N$6: BUZZER.N R8.1
N$7: D12.P$2 R19.1
N$8: J6.1(DATA2) R13.1
N$9: GNSS.6(VBATT) GNSS.7(VCC_IO) GNSS.8(VCC) L6.2
N$10: C22.2 U1.9(CAP)
N$11: R11.2 U1.17(COM3)
N$12: J6.8(DAT1) R72.1
N$14: R74.2 R75.1 U9.6(AIN2)
N$15: R14.2 U1.11(NRESET)
N$16: R22.2 REG_CAM.10(VC)
N$17: R76.2 R77.1 U9.7(AIN3)
N$19: C110.2 R22.1
N$21: C59.2 L9.1 REG_3V3.26(SW2_1) REG_3V3.27(SW2_2)
N$22: L7.1 LNA.5(AI)
N$23: C37.1 L7.2
N$24: C33.2 SAW.A(OUT)
N$25: LNA.3(AO) SAW.C(IN)
N$26: C37.2 IC3.5(J1)
N$27: CHIP_ANT.1(FEEDING) IC3.1(J3)
N$28: IC3.3(J2) J8.1
N$29: C42.2 SX1272.2(VR_ANA)
N$30: C43.2 SX1272.3(VR_DIG)
N$31: C44.1 C45.2 L1.2
N$32: C45.1 IC4.3(J2)
N$33: L2.1 SX1272.27(PA_BOOST)
N$34: L1.1 SX1272.25(RFI)
N$35: C46.1 C47.2 L2.2 L5.2
N$36: C47.1 L3.1
N$37: C48.1 C50.2 L3.2 L4.1
N$38: C49.1 C50.1 IC4.1(J3) L4.2
N$39: C51.1 C52.1 L5.1 SX1272.28(VR_PA)
N$40: C53.2 IC4.5(J1)
N$41: C53.1 J12.1
N$42: C99.+ D10.1(K) D11.P$1 IC9.2(VDD) R63.1 R65.2
N$43: R41.2 REG_3V3.10(VC)
N$44: IC9.1(SENSE) Q2.2(S) R63.2
N$45: C34.2 R41.1
N$46: R42.2 REG_3V3.14(RT)
N$47: C35.2 REG_3V3.1(BST3)
N$48: C60.1 L9.2 REG_3V3.24(SW1_1) REG_3V3.25(SW1_2)
N$49: C59.1 REG_3V3.28(BST2)
N$51: C57.1 IC6.5(SW) L8.1
N$52: D3.P$2 R28.2
N$53: C54.2 C55.1 D1.1(K) Q1.4(G) R18.2
N$54: D4.P$2 R29.2
N$55: D5.P$2 R34.2
N$56: C60.2 REG_3V3.23(BST1)
N$57: R32.2 REG_5V.10(VC)
N$58: C63.2 R32.1
N$59: R33.2 REG_5V.14(RT)
N$60: C64.2 REG_5V.1(BST3)
N$61: C66.2 L10.1 REG_5V.26(SW2_1) REG_5V.27(SW2_2)
N$62: C67.1 L10.2 REG_5V.24(SW1_1) REG_5V.25(SW1_2)
N$63: C66.1 REG_5V.28(BST2)
N$64: C67.2 REG_5V.23(BST1)
N$65: R38.2 REG_FIN_1.10(VC)
N$66: C70.2 R38.1
N$67: R39.2 REG_FIN_1.14(RT)
N$68: C71.2 REG_FIN_1.1(BST3)
N$69: C73.2 L11.1 REG_FIN_1.26(SW2_1) REG_FIN_1.27(SW2_2)
N$70: C74.1 L11.2 REG_FIN_1.24(SW1_1) REG_FIN_1.25(SW1_2)
N$71: C73.1 REG_FIN_1.28(BST2)
N$72: C74.2 REG_FIN_1.23(BST1)
N$73: R45.2 REG_FIN_2.10(VC)
N$74: C77.2 R45.1
N$75: R46.2 REG_FIN_2.14(RT)
N$76: C78.2 REG_FIN_2.1(BST3)
N$77: C80.2 L12.1 REG_FIN_2.26(SW2_1) REG_FIN_2.27(SW2_2)
N$78: C81.1 L12.2 REG_FIN_2.24(SW1_1) REG_FIN_2.25(SW1_2)
N$79: C80.1 REG_FIN_2.28(BST2)
N$80: C81.2 REG_FIN_2.23(BST1)
N$81: R49.2 REG_TVC_1.10(VC)
N$82: C84.2 R49.1
N$83: R50.2 REG_TVC_1.14(RT)
N$84: C85.2 REG_TVC_1.1(BST3)
N$85: C87.2 L13.1 REG_TVC_1.26(SW2_1) REG_TVC_1.27(SW2_2)
N$86: C88.1 L13.2 REG_TVC_1.24(SW1_1) REG_TVC_1.25(SW1_2)
N$87: C87.1 REG_TVC_1.28(BST2)
N$88: C88.2 REG_TVC_1.23(BST1)
N$89: R53.2 REG_TVC_2.10(VC)
N$90: C91.2 R53.1
N$91: R54.2 REG_TVC_2.14(RT)
N$92: C92.2 REG_TVC_2.1(BST3)
N$93: C94.2 L14.1 REG_TVC_2.26(SW2_1) REG_TVC_2.27(SW2_2)
N$94: C95.1 L14.2 REG_TVC_2.24(SW1_1) REG_TVC_2.25(SW1_2)
N$95: C94.1 REG_TVC_2.28(BST2)
N$96: C95.2 REG_TVC_2.23(BST1)
N$97: D6.P$2 R58.1
N$98: D7.P$2 R59.1
N$99: C96.+ D8.1(K) D9.P$1 IC8.2(VDD) R60.1 R62.2
N$100: IC8.1(SENSE) Q3.2(S) R60.2
N$101: D9.P$2 R61.1
N$102: IC8.3(STAT1) R61.2
N$103: IC8.4(EN) R62.1
N$104: IC8.8(DRV) Q3.1(G)
N$105: D11.P$2 R64.1
N$106: C97.2 IC8.5(TIMER)
N$107: IC9.3(STAT1) R64.2
N$108: IC9.4(EN) R65.1
N$109: IC9.8(DRV) Q2.1(G)
N$110: C101.2 IC9.5(TIMER)
N$111: CHG_BST.10(VC) R66.2
N$112: C104.2 R66.1
N$113: CHG_BST.14(RT) R67.2
N$114: C105.2 CHG_BST.1(BST3)
N$115: C107.2 CHG_BST.26(SW2_1) CHG_BST.27(SW2_2) L15.1
N$116: C108.1 CHG_BST.24(SW1_1) CHG_BST.25(SW1_2) L15.2
N$117: C107.1 CHG_BST.28(BST2)
N$118: C108.2 CHG_BST.23(BST1)
N$119: R23.2 REG_CAM.14(RT)
N$120: C111.2 REG_CAM.1(BST3)
N$121: Q5.1(G) U$3.4(Y)
N$122: C113.2 L16.1 REG_CAM.26(SW2_1) REG_CAM.27(SW2_2)
N$123: C114.1 L16.2 REG_CAM.24(SW1_1) REG_CAM.25(SW1_2)
N$124: C113.1 REG_CAM.28(BST2)
N$125: C114.2 REG_CAM.23(BST1)
N_RXTX: IC4.6(V2) U$2.4(Y)
N_S: IC3.6(V2) U$1.4(Y)
P1: C4.1 REG_3V3.8(PROG) REG_3V3.12(MPPC) REG_3V3.13(VCC)
P2: C62.1 REG_5V.8(PROG) REG_5V.12(MPPC) REG_5V.13(VCC)
P3: C69.1 REG_FIN_1.8(PROG) REG_FIN_1.12(MPPC) REG_FIN_1.13(VCC)
P4: C76.1 REG_FIN_2.8(PROG) REG_FIN_2.12(MPPC) REG_FIN_2.13(VCC)
P5: C83.1 REG_TVC_1.8(PROG) REG_TVC_1.12(MPPC) REG_TVC_1.13(VCC)
P6: C90.1 REG_TVC_2.8(PROG) REG_TVC_2.12(MPPC) REG_TVC_2.13(VCC)
P7: C103.1 CHG_BST.8(PROG) CHG_BST.12(MPPC) CHG_BST.13(VCC)
P8: C109.1 REG_CAM.8(PROG) REG_CAM.12(MPPC) REG_CAM.13(VCC)
PYRO_DROGUE: J3.2 U5.3(D)
PYRO_IGN1: J4.2 U3.3(D)
PYRO_IGN2: J5.2 U2.3(D)
PYRO_MAIN: J2.2 U7.3(D)
QSPI_SCLK: FLASH.6(CLK) RP2040.52(QSPI_SCLK)
QSPI_SD0: FLASH.5(DI(IO0)) RP2040.53(QSPI_SD0)
QSPI_SD1: FLASH.2(DO(IO1)) RP2040.55(QSPI_SD1)
QSPI_SD2: FLASH.3(/WP(IO2)) RP2040.54(QSPI_SD2)
QSPI_SD3: FLASH.7(/HOLD/RESET(IO3)) RP2040.51(QSPI_SD3)
QSPI_SS: FLASH.1(/CS) R0.1 R1.2 RP2040.56(QSPI_SS)
RXTX: IC4.4(V1) SX1272.23(RXTX) U$2.2(A)
S: IC3.4(V1) RP2040.34(GPIO22) U$1.2(A)
SCK: J6.5(CLK) R83.1 RP2040.29(GPIO18) SX1272.17(SCK)
SCL: AC1.12(SCLK/SCL) IC1.4(SCK) R73.1 RP2040.18(GPIO15) U1.19(COM1) U6.10(SCL) U9.10(SCL)
SDA: AC1.2(SDI/SDA) IC1.3(SDI) R80.1 RP2040.17(GPIO14) U1.20(COM0) U6.9(SDA) U9.9(SDA)
SDO: IC1.5(SDO) R9.2
SS_ADC: SS.P$3 U9.5(AIN1)
TVC_1: RP2040.9(GPIO7) TVC_1.P$3
TVC_2: RP2040.8(GPIO6) TVC_2.P$3
TVC_3: RP2040.16(GPIO13) TVC_3.P$3
TVC_4: RP2040.6(GPIO4) TVC_4.P$3
USB+: Q4.2(S) Q5.2(S) R70.1 X6.A4B9(VBUS) X6.B4A9(VBUS)
USB_BOOT: BOOT.2 R1.1
USB_BST: C105.1 C106.2 CHG_BST.2(PVOUT_1) CHG_BST.4(PVOUT_2) CHG_BST.5(ISP) CHG_BST.6(ISN) D8.2(A) D10.2(A) Q6.4(G) Q7.4(G) R68.2
USB_CHG: C102.1 CHG_BST.16(EN/UVLO) CHG_BST.17(VIN) CHG_BST.19(PVIN_1) CHG_BST.20(PVIN_2) CHG_BST.21(PVIN_3) Q4.3(D)
USB_DM: R4.1 RP2040.46(USB_DM)
USB_DP: R3.1 RP2040.47(USB_DP)
V_CAM: C111.1 C112.2 J10.2 J11.2 R24.2 REG_CAM.2(PVOUT_1) REG_CAM.4(PVOUT_2) REG_CAM.5(ISP) REG_CAM.6(ISN)
V_FIN_1: C71.1 C72.2 FIN_1.P$2 FIN_2.P$2 R40.2 REG_FIN_1.2(PVOUT_1) REG_FIN_1.4(PVOUT_2) REG_FIN_1.5(ISP) REG_FIN_1.6(ISN)
V_FIN_2: C78.1 C79.2 FIN_3.P$2 FIN_4.P$2 R47.2 R88.1 REG_FIN_2.2(PVOUT_1) REG_FIN_2.4(PVOUT_2) REG_FIN_2.5(ISP) REG_FIN_2.6(ISN)
V_TVC_1: C85.1 C86.2 R51.2 R86.1 REG_TVC_1.2(PVOUT_1) REG_TVC_1.4(PVOUT_2) REG_TVC_1.5(ISP) REG_TVC_1.6(ISN) TVC_1.P$2 TVC_2.P$2
V_TVC_2: C92.1 C93.2 R55.2 REG_TVC_2.2(PVOUT_1) REG_TVC_2.4(PVOUT_2) REG_TVC_2.5(ISP) REG_TVC_2.6(ISN) TVC_3.P$2 TVC_4.P$2
VBUS: C56.1 D2.2(A) D5.P$1 IC6.3(!SHDN) IC6.6(VCC) Q5.3(D)
VCC: C1.1 C18.1 C61.1 D2.1(K) D13.1(K) REG_3V3.16(EN/UVLO) REG_3V3.17(VIN) REG_3V3.19(PVIN_1) REG_3V3.20(PVIN_2) REG_3V3.21(PVIN_3) REG_5V.16(EN/UVLO) REG_5V.17(VIN) REG_5V.19(PVIN_1) REG_5V.20(PVIN_2) REG_5V.21(PVIN_3) REG_CAM.17(VIN) REG_CAM.19(PVIN_1) REG_CAM.20(PVIN_2) REG_CAM.21(PVIN_3)
VCC_CTRL: 1S_POW.3(COMMON_K) C68.1 C75.1 C82.1 C89.1 Q1.1(S_1) Q1.2(S_2) Q1.3(S_3) REG_FIN_1.17(VIN) REG_FIN_1.19(PVIN_1) REG_FIN_1.20(PVIN_2) REG_FIN_1.21(PVIN_3) REG_FIN_2.17(VIN) REG_FIN_2.19(PVIN_1) REG_FIN_2.20(PVIN_2) REG_FIN_2.21(PVIN_3) REG_TVC_1.17(VIN) REG_TVC_1.19(PVIN_1) REG_TVC_1.20(PVIN_2) REG_TVC_1.21(PVIN_3) REG_TVC_2.17(VIN) REG_TVC_2.19(PVIN_1) REG_TVC_2.20(PVIN_2) REG_TVC_2.21(PVIN_3)
VCC_PYRO: D7.P$1 J2.1 J3.1 J4.1 J5.1 J13.1
VCC_RF: C36.2 GNSS.14(VCC_RF) LNA.2(VCC) LNA.6(PON)
VOLT_DP: C28.2 IC2.4(VOUT) R74.1
VOLT_MOTOR: MOTOR.P$3 R76.1
XIN: C2.2 RP2040.20(XIN) XTAL.3(OUT)
XIN1: 32XO.3(OUT) C38.2 SX1272.4(XTA)
XIN32: C23.1 U1.27(XIN32) Y1.1
XOUT: R5.2 RP2040.21(XOUT)
XOUT1: 32XO.1(TRI) C39.2 SX1272.5(XTB)
XOUT32: C24.1 U1.26(XOUT32) Y1.2
XT30+: C98.+ IC8.7(VBAT) Q3.3(D) Q7.1(S_1) Q7.2(S_2) Q7.3(S_3) R78.1 U$11.P$1(+)
XT60+: C100.+ IC9.7(VBAT) J7.P(POS) Q2.3(D) Q6.1(S_1) Q6.2(S_2) Q6.3(S_3) R16.1
Unconnected: AC1.5(INT1) AC1.6(INT2) AC1.11(NC) CHG_BST.7(PGOOD) GNSS.4(1PPS) GNSS.5(WAKE-UP) GNSS.9(SYS_RSTN) GNSS.13(ANT_OFF) GNSS.15(RESERVED_1) GNSS.16(SDA) GNSS.17(SCL) GNSS.18(RESERVED_2) IC2.1(N/C_1) IC2.5(N/C_2) IC2.6(N/C_3) IC2.7(N/C_4) IC2.8(N/C_5) REG_3V3.7(PGOOD) REG_5V.7(PGOOD) REG_CAM.7(PGOOD) REG_FIN_1.7(PGOOD) REG_FIN_2.7(PGOOD) REG_TVC_1.7(PGOOD) REG_TVC_2.7(PGOOD) RP2040.24(SWCLK) RP2040.25(SWD) RP2040.38(GPIO26_ADC0) RP2040.39(GPIO27_ADC1) RP2040.40(GPIO28_ADC2) RP2040.41(GPIO29_ADC3) SX1272.6(RESET) SX1272.9(DIO0) SX1272.10(DIO1/DCLK) SX1272.11(DIO2/DATA) SX1272.12(DIO3) SX1272.13(DIO4) SX1272.14(DIO5) SX1272.21(RF_MOD) SX1272.24(RFO) U1.14(INT) U6.2(ALERT/RDY) U9.2(ALERT/RDY) X6.A8(SBU1) X6.B8(SBU2)

## Notes on the sheet
- TESEO-LIV3F : GNSS Chip
  
  TX & RX : For UART communication
  SCL & SDA : For I2C communication
  PPS : Time pulse from GNSS
  VCC_RF : Power output from chip to active antenna
  
  C20 & C22 : Blocks DC voltage
  C18 & C21 : Decoupling capacitors
  
  GNSS_SWITCH : Used to switch between 3 antennae
  
  V1 : 0, V2 : 0 - RF_IN Isolated
  V1 : 1, V2 : 0 - RF_IN to RF1
  V1 : 0, V2 : 1 - RF_IN to RF2
  V1 : 1, V2 : 1 - RF_IN to RF3
  
  Notes
  
  1. VCC_IO must be 3.3V, VCC and VBATT can be 2.1V-4.3V
  2. Do not add pull-up resistors to I2C lines
  3. GPS_RESET is active low
  4. ANT_OFF is active high. LNA is turned off, not bypassed.
  5. Use small components = small pads = small impedance jumps
  6. If component is connected 50 ohm line, place pad on the line
  7. Try to keep 50 ohm trace width close to pad width
  8. Try to increase GND area near RF GND pins
  9. Avoid traces under chip
  10. Keep LNA close to chip
  11. For patch antenna on opposite side of board, keep big GND pad with a fat via for the antenna pin. Bigger the GND pad, better the antenna performance
  
  Purchase Links
  
  TESEO-LIV3F : https://in.element14.com/stmicroelectronics/teseo-liv3f/rf-receiver-1-57542ghz-40-to-85deg/dp/2980958
  
  LNA : https://robu.in/product/bga725l6e6327ftsa1-infineon-rf-amplifier-ic-20-db-gain-0-65-db-noise-1-55-ghz-to-1-615-ghz-1-5-v-to-3-6-v-supply-dfn-6/
  
  3-Way RF Switch : https://in.element14.com/infineon/bgs13sn8e6327xtsa1/rf-switch-sp3t-0-1-6ghz-tsnp-8/dp/2780982?ICID=I-RP-STM7REC-1
  
  SAW Filter : https://in.element14.com/abracon/afs14a04-1575-42-t3/saw-filter-1-57642ghz-smd-5/dp/3819768
  
  W3010 Chip Antenna : https://in.element14.com/pulse-electronics/w3010/ceramic-antenna-1-56-1-61ghz/dp/3861087
  
  Patch Antenna : https://evelta.com/gps-and-glonass-passive-patch-antenna-18x18x04-mm-eve-181804gnss-cp/
  
  External Antenna : https://robu.in/product/1575-mhz-gps-glonass-gnss-antenna-for-gps-gsm-module-with-3-meter-cable-good-quality/
  
  Edge Mount Female SMA Connector (1.6mm board thickness) : https://evelta.com/sma-connector-female-pcb-edge-straight/
  
  10 nF Capacitor : https://evelta.com/10-nf-50v-0603-smd-multi-layer-ceramic-capacitor-0603b103k500ct-walsin/
  
  27 nH Inductor : https://evelta.com/27-nh-0603-surface-mount-high-frequency-inductor-vhf160808h27njt/
  
  10k ohm Resistor : https://evelta.com/10k-1-100mw-0603-chip-resistor/
  
  120 pF Capacitor : https://robu.in/product/mc0603n121j500ct-murata-smd-multilayer-ceramic-capacitor-120-pf-50-v-0603-1608-metric-±-5-c0g-np0-mc/
  
  1 nF Capacitor : https://evelta.com/1-nf-50v-0603-smd-multi-layer-ceramic-capacitor-0603b102k500ct-walsin/
  
  5.6 nH Inductor : https://evelta.com/5-6-nh-0603-surface-mount-high-frequency-inductor-vhf160808h5n6st/
- USB
- GNSS
- RP2040
- VBUS : Power from USB
  D+ : Data line 1
  D- : Data line 2
  CC1 & CC2 : Not sure what they are for but both must be pulled to GND using 5.1k ohm resistors when using Type-C USB
  SHLD : Outer covering of female USB connector. Should be grounded
  GND : Ground
  
  Try to route D+ and D- so that the differential impedance between them is as close to 90 ohm as possible.
  
  
  
  D1 : Diode to prevent reverse flow of current just in case (to protect my beautiful laptop)
  
  
  Purchase Links
  
  
  USB connector : https://evelta.com/mup-u20401-1---usb-type-c-connector-receptacle-smt-16pin-l7.35/
  
  Diode : https://evelta.com/schottky-diode-1a-sod-323-b5819ws/
  
  5.1k Resistors : https://evelta.com/5-1-kohm-1-0603-thick-film-chip-resistor-smd-rc0603fr-075k1l/
- Power
  
  C9-C16 : Decoupling capacitors for RP2040. Must be placed close to the power pins.
  C8 must be close to Pin 45, C10 must be close to Pin 44, rest can be jumbled around as you may like.
  There is one decoupling capacitor less than number of power pins. Not sure why, that's just how it is in the hardware design manual of the RP2040.
  There is a third party improved version of the pico : https://github.com/diminDDL/ProPico, and Pin 43 is simply left floating in that, so I did the same. Might update in future.
  
  
  USB
  
  R3 & R4 : Termination resistors for USB data lines. Must be placed close to the IC.
  
  
  Flash
  
  RP2040 communicates with flash via the 6 QSPI pins. Try to keep the traces connecting the RP2040 and the flash short.
  
  
  GPIO
  
  GPIO capability for each pin (UART / I2C / SPI) is stated in the RP2040 datasheet. Last 4 pins can act as ADC with input upto 3.3V.
  
  
  Crystal Oscillator
  
  RP2040 uses external 12 MHz crystal oscillator for timing via XIN & XOUT pins.
  Try to keep the traces connecting the RP2040 and the crystal oscillator short.
  
  Misc
  
  It is recommended to tie RUN to 3V3.
  
  
  Purchase Links
  
  RP2040 : https://robu.in/product/raspberry-pi-rp2040/
  
  100 nF Capacitors : https://evelta.com/100-nf-50v-0603-smd-multi-layer-ceramic-capacitor-0603b104k500ct-walsin/
  
  1 uF Capacitors : Same as POWER
  
  27.4 ohm Resistors : https://evelta.com/27-4-ohm-1-0603-thick-film-chip-resistor-0603waf274jt5e/
- FLASH
- SX1272
- Power
  
  C5 - Decoupling capacitor for flash. Must pe placed close to the flash.
  
  
  Boot
  
  
  When CS is pulled LOW on startup by pressing the button, the flash boots up as a mass storage device (like an SD Card). 
  This is similar to plugging in a USB cable into a Pico while holding the BOOTSEL button.
  
  As a precaution, CS is pulled HIGH using R2, but the hardware design manual for the RP2040 states that it is not necessary for this particular flash chip, hence the Do Not Fit (DNF)
  
  Keep R1 & R2 close to the flash.
  
  
  Purchase Links
  
  
  Flash : https://evelta.com/serial-nor-flash-memory-128mbit-8pin-soic/
  
  1k Resistor : https://evelta.com/1k-1-100mw-0603-chip-resistor/
  
  10k Resistor : https://evelta.com/10k-1-100mw-0603-chip-resistor/
  
  100 nF Capacitor : Same as RP2040
  
  Button : https://evelta.com/tactile-switch-2pin-rectangle-button-red-stem-spst-smd-ts3625a-ht/
- Purchase Links
  
  
  LED : https://evelta.com/green-led-smd-0603-package/
  
  Buzzer : https://www.sunrom.com/p/electromagnetic-passive-buzzer-3-5v-smd-pcb-mount-mlt-8530
- CRYSTAL OSCILLATOR
- Crystal oscillators need a load capacitance to osciallte at the right frequency.
  This particular chip needs 12 pF.
  So, 2 capacitors of 22 pF each are placed to give an equivalent load capacitance of  11 pF. 
  24 pF capacitors were not available, but these get the job done.
  
  1k ohm resistor to ensure the oscillator is not overloaded.
  
  VDD and GND are shorted in the schematic, but the ones used in the actual board have 2 GND pads.
  This library was only used because it had the same dimensions.
  
  
  Purchase Links
  
  
  Crystal Oscillator : https://evelta.com/ysx321sl-12mhz-12pf-10ppm-4pins-smd-smt-metal-surface-quartz-crystal/
  
  22 pF Capacitors : https://evelta.com/22-pf-50v-0603-smd-multi-layer-ceramic-capacitor-0603n220j500ct-walsin/

## Power pins joined to a net without a drawn wire
ADC_AVDD: RP2040.43(ADC_AVDD)

## Library data of the parts
1S_POW = V60D60C-M3_I:V60D60C-M3_I: Schottky Diodes & Rectifiers 60V 60A SMPD(TO-263AC) Source: Datasheet <https://componentsearchengine.com/Datasheets/1/V60D60C-M3_I.pdf>; DESCRIPTION: Schottky Diodes & Rectifiers 60V 60A SMPD(TO-263AC); HEIGHT: 1.8mm; MANUFACTURER_NAME: Vishay; MANUFACTURER_PART_NUMBER: V60D60C-M3/I
32XO XTAL = crystal:ASE: 3.3Vdc CMOS SMD CRYSTAL CLOCK OSCILLATOR SOurce: www.abracon.com; OC_FARNELL: unknown; OC_NEWARK: unknown
AC1 = KX134-1211:KX134-1211: Accelerometers Tri-Axis Acclrmtr 8g, 16g, 32g Source: Datasheet <https://www.mouser.it/datasheet/2/348/KX134-1211-Specifications-Rev-1.0-1659717.pdf>; DESCRIPTION: Accelerometers Tri-Axis Acclrmtr 8g, 16g, 32g; HEIGHT: 1mm; MANUFACTURER_NAME: Kionix; MANUFACTURER_PART_NUMBER: KX134-1211
AOA FIN_1-FIN_4 MOTOR SS TVC_1-TVC_4 = bt_con-jst-xh (1):03-JST: JST CONNECTOR
BOOT = switch-tact:DTSM-3
BUZZER = CMT-8530S-SMT:CMT-8530S-SMT: 8.5 mm, 3.6 Vo-p, 90 dB, Surface Mount (SMT), Magnetic Audio Transducer Buzzer Check availability <https://pricing.snapeda.com/parts/CMT-8530S-SMT-TR/CUI%20Devices/view-part?ref=eda>; AVAILABILITY: In Stock; CHECK_PRICES: https://www.snapeda.com/parts/CMT-8530S-SMT-TR/CUI+Devices/view-part/?ref=eda; CUI_PURCHASE_URL: https://www.cuidevices.com/product/audio/buzzers/audio-transducers/cmt-8530s-smt-tr?utm_source=snapeda.com&utm_medium=referral&utm_campaign=snapedaBOM; DESCRIPTION: 8.5 mm, 3.6 Vo-p, 90 dB, Surface Mount (SMT), Magnetic Audio Transducer Buzzer; MF: CUI Devices; MP: CMT-8530S-SMT-TR; PACKAGE: None; PRICE: None; PURCHASE-URL: https://www.snapeda.com/api/url_track_click_mouser/?unipart_id=649163&manufacturer=CUI Devices&part_name=CMT-8530S-SMT-TR&search_term=None; SNAPEDA_LINK: https://www.snapeda.com/parts/CMT-8530S-SMT-TR/CUI+Devices/view-part/?ref=snap
C1-C95 C97 C101-C115 = standardparts:CAPACITOR
C96 C98-C100 = microbuilder:CAP_TANTALUM: Tantalum Capacitors Wave footprints have larger pads and are meant to be used for hand soldering. Reflow footprints are optimised for solder paste and a reflow oven. EIA3216-18/A-[R/W] - Size A / 3216-18 / 1206 footprint 4.7µF 25V 10% Tantalum Capacitor 10µF 16V 10% Tantalum Capacitor [Digikey: 495-2236-2-ND] EIA3528-21/B-[R/W] - Size B / 3528-21 47µF 10V 10% Tantalum Capactior [Digikey: 495-2216-1-ND] EIA6032-28/C-[R/W] - Size C / 6032-28 10µF 35V 20% Tantalum Capacitor [Digikey: 495-2285-1-ND] 100µF 16V 10% Tantalum Capactior [Digikey: 399-5214-1-ND]
CHG_BST REG_3V3 REG_5V REG_CAM REG_FIN_1 REG_FIN_2 REG_TVC_1 REG_TVC_2 = LT3120JV#PBF:LT3120JV#PBF: Switching Voltage Regulators 24V, 6.5A Sync Buck-Boost Converter Source: Datasheet <https://www.mouser.jp/datasheet/2/609/lt3120-2401157.pdf>; DESCRIPTION: Switching Voltage Regulators 24V, 6.5A Sync Buck-Boost Converter; HEIGHT: 0.83mm; MANUFACTURER_NAME: Analog Devices; MANUFACTURER_PART_NUMBER: LT3120JV#PBF
CHIP_ANT = W3010:W3010: 1.575GHz GPS Chip RF Antenna 2.8dBi Solder Surface Mount Check availability <https://pricing.snapeda.com/parts/W3010/PulseLarsen%20Antennas/view-part?ref=eda>; AVAILABILITY: Not in stock; CHECK_PRICES: https://www.snapeda.com/parts/W3010/PulseLarsen+Antennas/view-part/?ref=eda; DESCRIPTION: 1.575GHz GPS Chip RF Antenna - 2.8dBi Solder Surface Mount; MF: PulseLarsen Antennas; MP: W3010; PACKAGE: None; PRICE: None; PURCHASE-URL: https://www.snapeda.com/api/url_track_click_mouser/?unipart_id=242644&manufacturer=PulseLarsen Antennas&part_name=W3010&search_term=None; SNAPEDA_LINK: https://www.snapeda.com/parts/W3010/PulseLarsen+Antennas/view-part/?ref=snap
D1 D2 D8 D10 D13 = RSX501LAM20TR:RSX501LAM20TR: 20V, 5A, SOD-128, Schottky Barrier Diode Source: Datasheet <https://fscdn.rohm.com/en/products/databook/datasheet/discrete/diode/schottky_barrier/rsx501lam20tr-e.pdf>; DESCRIPTION: 20V, 5A, SOD-128, Schottky Barrier Diode; HEIGHT: 1.05mm; MANUFACTURER_NAME: ROHM Semiconductor; MANUFACTURER_PART_NUMBER: RSX501LAM20TR
D3-D7 D9 D11 D12 LED = standardparts:LED
FLASH = W25Q128JVSIQ:W25Q128JVSIQ: Check availability <https://pricing.snapeda.com/parts/W25Q128JVSIQ/Winbond%20Electronics/view-part?ref=eda>; AVAILABILITY: In Stock; CHECK_PRICES: https://www.snapeda.com/parts/W25Q128JVSIQ/Winbond+Electronics/view-part/?ref=eda; DESCRIPTION: FLASH - NOR Memory IC 128Mb (16M x 8) SPI - Quad I/O, QPI, DTR 133 MHz 8-SOIC; MF: Winbond Electronics; MP: W25Q128JVSIQ; PACKAGE: SOIC-8 Winbond Electronics; PRICE: None; SNAPEDA_LINK: https://www.snapeda.com/parts/W25Q128JVSIQ/Winbond+Electronics/view-part/?ref=snap
GNSS = TESEO-LIV3F:TESEO-LIV3F: GPS Modules Tiny GNSS module Source: Datasheet <https://componentsearchengine.com/Datasheets/1/TESEO-LIV3F.pdf> Check availability <https://pricing.snapeda.com/parts/TESEO-LIV3F/STMicroelectronics/view-part?ref=eda>; AVAILABILITY: In Stock; CHECK_PRICES: https://www.snapeda.com/parts/TESEO-LIV3F/STMicroelectronics/view-part/?ref=eda; DESCRIPTION: - RF Receiver BeiDou, Galileo, GLONASS, GNSS, GPS 1.575GHz -163dBm Not Included 18-LCC (9.7x10.1); MF: STMicroelectronics; MP: TESEO-LIV3F; PACKAGE: SMD-18 STMicroelectronics; PRICE: None; PURCHASE-URL: https://www.snapeda.com/api/url_track_click_mouser/?unipart_id=1474256&manufacturer=STMicroelectronics&part_name=TESEO-LIV3F&search_term=None; SNAPEDA_LINK: https://www.snapeda.com/parts/TESEO-LIV3F/STMicroelectronics/view-part/?ref=snap
H1-H4 = holes:MOUNT-PAD-ROUND: MOUNTING PAD, round
IC1 = BMP280-standalone:BMP280: The BMP280 is an absolute barometric pressure sensor especially designed for mobile applications. The sensor module is housed in an extremely compact 8-pin metal-lid LGA package with a footprint of only 2.0 × 2.5 mm2 and 0.95 mm package height. Its small dimensions and its low power consumption of 2.7 μA @1Hz allow the implementation in battery driven devices such as mobile phones, GPS modules or watches. The library has been designed by Richard Magdycz <https://www.facebook.com/groups/eaglecadsoftUK>
IC2 = MPXV5100DP:MPXV5100DP: Board Mount Pressure Sensors SOP DUAL PORT Source: Datasheet <http://www.nxp.com/docs/en/data-sheet/MPX5100.pdf>; DESCRIPTION: Board Mount Pressure Sensors SOP DUAL PORT; HEIGHT: 9.906mm; MANUFACTURER_NAME: NXP; MANUFACTURER_PART_NUMBER: MPXV5100DP
IC3 IC4 = AS179-92LF:AS179-92LF: SKYWORKS SOLUTIONS - AS179-92LF - IC, SWITCH, RF, SPDT, 0.02-3.0GHZ Source: Datasheet <https://datasheet.datasheetarchive.com/originals/distributors/Datasheets-DGA1/141541.pdf>; DESCRIPTION: SKYWORKS SOLUTIONS - AS179-92LF - IC, SWITCH, RF, SPDT, 0.02-3.0GHZ; HEIGHT: 1mm; MANUFACTURER_NAME: Skyworks; MANUFACTURER_PART_NUMBER: AS179-92LF
IC6 = MAX8574EUT+T:MAX8574EUT+T: MAXIM INTEGRATED PRODUCTS - MAX8574EUT+T - DC/DC CONV, BOOST, 800KHZ, 85DEG C Source: Datasheet <https://datasheets.maximintegrated.com/en/ds/MAX8570-MAX8575.pdf>; DESCRIPTION: MAXIM INTEGRATED PRODUCTS - MAX8574EUT+T - DC/DC CONV, BOOST, 800KHZ, 85DEG C; HEIGHT: 1.45mm; MANUFACTURER_NAME: Analog Devices; MANUFACTURER_PART_NUMBER: MAX8574EUT+T
IC8 IC9 = MCP73843-420I_MS:MCP73843-420I_MS: Li-Ion Charge Controller 4.2V MSOP8 Source: Datasheet <http://ww1.microchip.com/downloads/en/DeviceDoc/21823D.pdf>; DESCRIPTION: Li-Ion Charge Controller 4.2V MSOP8; HEIGHT: 1.1mm; MANUFACTURER_NAME: Microchip; MANUFACTURER_PART_NUMBER: MCP73843-420I/MS
J2-J5 J9 J13 = 282834-2:282834-2: Check availability <https://pricing.snapeda.com/parts/282834-2/TE%20Connectivity/view-part?ref=eda>; AVAILABILITY: In Stock; CENTERLINE_PITCH: 2.54 mm[.1 in]; CHECK_PRICES: https://www.snapeda.com/parts/282834-2/TE+Connectivity+AMP+Connectors/view-part/?ref=eda; COMMENT: 282834-2; DESCRIPTION: Terminal Block Connector PCB 2.54 mm 30-16 AWG Green 10 A 150 V M1.6 | TE Connectivity 282834-2; EU_ROHS_COMPLIANCE: Compliant with Exemptions; MF: TE Connectivity; MP: 282834-2; NUMBER_OF_POSITIONS: 2; PACKAGE: None; PRICE: None; PURCHASE-URL: https://www.snapeda.com/api/url_track_click_mouser/?unipart_id=431057&manufacturer=TE Connectivity&part_name=282834-2&search_term=None; SNAPEDA_LINK: https://www.snapeda.com/parts/282834-2/TE+Connectivity+AMP+Connectors/view-part/?ref=snap
J6 = 503182-1852:503182-1852: Micro SD Normal UltraLowPro8CktEmbsTpPkg Source: Datasheet <https://www.molex.com/pdm_docs/sd/5031821852_sd.pdf>; DESCRIPTION: Micro SD Normal UltraLowPro8CktEmbsTpPkg; HEIGHT: mm; MANUFACTURER_NAME: Molex; MANUFACTURER_PART_NUMBER: 503182-1852
J7 = XT60-M:XT60-M: Check availability <https://pricing.snapeda.com/parts/XT60-M/AMASS/view-part?ref=eda>; AVAILABILITY: Not in stock; DESCRIPTION: Plug; DC supply; XT60; male; PIN: 2; for cable; soldered; 30A; 500V; MF: AMASS; MP: XT60-M; PACKAGE: Package; PRICE: None
J8 J12 = CON-SMA-EDGE-S:CON-SMA-EDGE-S: Check availability <https://pricing.snapeda.com/parts/CON-SMA-EDGE-S/RF%20Solutions/view-part?ref=eda>; AVAILABILITY: In Stock; CHECK_PRICES: https://www.snapeda.com/parts/CON-SMA-EDGE-S/RF+Solutions/view-part/?ref=eda; DESCRIPTION: SMA Connector Jack, Female Socket - Board Edge, End Launch Solder; MF: RF Solutions; MP: CON-SMA-EDGE-S; PACKAGE: None; PRICE: None; PURCHASE-URL: https://www.snapeda.com/api/url_track_click_mouser/?unipart_id=557794&manufacturer=RF Solutions&part_name=CON-SMA-EDGE-S&search_term=None; SNAPEDA_LINK: https://www.snapeda.com/parts/CON-SMA-EDGE-S/RF+Solutions/view-part/?ref=snap
J10 J11 = B2B-XH-A_LF__SN_:B2B-XH-A(LF)(SN): Check availability <https://pricing.snapeda.com/parts/B2B-XH-A%28LF%29%28SN%29/JST%20Sales/view-part?ref=eda>; AVAILABILITY: In Stock; CHECK_PRICES: https://www.snapeda.com/parts/B2B-XH-A(LF)(SN)/JST+Sales+America+Inc./view-part/?ref=eda; DESCRIPTION: Connector Header Through Hole 2 position 0.098 (2.50mm); MF: JST Sales; MP: B2B-XH-A(LF)(SN); PACKAGE: None; PRICE: None; SNAPEDA_LINK: https://www.snapeda.com/parts/B2B-XH-A(LF)(SN)/JST+Sales+America+Inc./view-part/?ref=snap
L1-L16 = standardparts:RF-INDUCTOR
LNA = BGA725L6E6327FTSA1:BGA725L6E6327FTSA1: IC AMP GPS 1.55-1.615GHZ TSLP6-2 Check availability <https://pricing.snapeda.com/parts/BGA725L6E6327FTSA1/Infineon%20Technologies/view-part?ref=eda>; AVAILABILITY: In Stock; CHECK_PRICES: https://www.snapeda.com/parts/BGA725L6E6327FTSA1/Infineon+Technologies/view-part/?ref=eda; DESCRIPTION: The BGA725L6 is a front-end low noise amplifier for Global Navigation Satellite Systems (GNSS) from 1550 MHz to 1615 MHz like GPS, GLONASS, Beidou, Galileo and others.; MF: Infineon Technologies; MP: BGA725L6E6327FTSA1; PACKAGE: XFDFN-6 Infineon Technologies; PRICE: None; PURCHASE-URL: https://www.snapeda.com/api/url_track_click_mouser/?unipart_id=426432&manufacturer=Infineon Technologies&part_name=BGA725L6E6327FTSA1&search_term=None; SNAPEDA_LINK: https://www.snapeda.com/parts/BGA725L6E6327FTSA1/Infineon+Technologies/view-part/?ref=snap
Q1 Q6 Q7 = SI7625DN-T1-GE3:SI7625DN-T1-GE3: VISHAY - SI7625DN-T1-GE3 - MOSFET, P CHANNEL, -30V, -35A, POWERPAK 1212-8 Source: Datasheet <https://www.vishay.com/docs/65737/si7625dn.pdf>; DESCRIPTION: VISHAY - SI7625DN-T1-GE3 - MOSFET, P CHANNEL, -30V, -35A, POWERPAK 1212-8; HEIGHT: 1.12mm; MANUFACTURER_NAME: Vishay; MANUFACTURER_PART_NUMBER: SI7625DN-T1-GE3
Q2-Q5 = microbuilder:MOSFET-P: P-Channel Mosfet LEGEND VDS: Voltage Drain-Source ID: Drain Current RDS(ON): Drain-Source On-State Resistance VGS(TH): Gate-Source Threshold Voltage CISS: Drain-Source Input Capacitance SOT-23 Name VDS ID RDS(ON) VGS(TH) CISS Order Number IRLML5103 30V 760mA 600 mOhm -- 75pF @ 25V Digikey: IRLML5103PBFCT-ND IRLML6401 12V 4.3A 50 mOhm 950mV @ 250µA 830pF @ 10V Digikey: IRLML6401PBFTR-ND NTR0202PL 20V 400mA 800 mOhm 2.3V @ 250uA 70pF @ 5V Digikey: NTR0202PLT1GOSTR-ND NTR4101PT1G 20V 1.8A 85 mOhm 1.2V @ 250uA 675pF @ 10V Digikey: NTR4101PT1GOSCT-ND DMP2004K 20V 600mA 900 mOhm 1V @ 250uA 175pF @ 16V Digikey: DMP2004KDICT-ND PMV65XP 20V 3.9A 76 mOhm 950mV @ 1mA 725pF @ 20V Digikey: 568-2358-2-ND TO-252 Name VDS ID RDS(ON) VGS(TH) CISS Order Number AOD417 30V 25A 34 mOhm 3V @ 250µA 920pF @ 15V Digikey: 785-1106-2-ND
R0 R1-R11 R13-R56 R58-R70 R72-R89 = standardparts:RESISTOR
RP2040 = RpiPico:RP2040-QFN56
SAW = AFS14A04-1575.42-T3:AFS14A04-1575.42-T3; MANUFACTURER: Abracon; MAXIMUM_PACKAGE_HEIGHT: 0.7mm; PARTREV: 04.16.13; SNAPEDA_PN: AFS14A04-1575.42-T3; STANDARD: Manufacturer Recommendations
SX1272 = SX1272IMLTRT:SX1272IMLTRT: SX1272 Series 860-1020 MHz 300 kbps Low Power Long Range Transceiver - QFN-28EP Check availability <https://pricing.snapeda.com/parts/SX1272IMLTRT/Semtech/view-part?ref=eda>; AVAILABILITY: In Stock; CHECK_PRICES: https://www.snapeda.com/parts/SX1272IMLTRT/Semtech+Corporation/view-part/?ref=eda; DESCRIPTION: IC RF TxRx Only 802.15.4 LoRa™ 860MHz ~ 1.02GHz 28-VQFN Exposed Pad; MF: Semtech; MP: SX1272IMLTRT; PACKAGE: VQFN-28 Semtech; PRICE: None; PURCHASE-URL: https://www.snapeda.com/api/url_track_click_mouser/?unipart_id=227639&manufacturer=Semtech&part_name=SX1272IMLTRT&search_term=None; SNAPEDA_LINK: https://www.snapeda.com/parts/SX1272IMLTRT/Semtech+Corporation/view-part/?ref=snap
U1 = BNO055:BNO055: BNO055 9-axis Absolute Orientation Sensor ( SiP ) w/Sensors and Sensor Fusion Check availability <https://pricing.snapeda.com/parts/BNO055/Bosch/view-part?ref=eda>; AVAILABILITY: In Stock; CHECK_PRICES: https://www.snapeda.com/parts/BNO055/Bosch+Sensortec/view-part/?ref=eda; DESCRIPTION: BNO055 series Accelerometer, Gyroscope, Magnetometer, 3 Axis Sensor Evaluation Board; MF: Bosch; MP: BNO055; PACKAGE: LGA-28 Bosch; PRICE: None; PURCHASE-URL: https://www.snapeda.com/api/url_track_click_mouser/?unipart_id=51961&manufacturer=Bosch&part_name=BNO055&search_term=None; SNAPEDA_LINK: https://www.snapeda.com/parts/BNO055/Bosch+Sensortec/view-part/?ref=snap
U2 U3 U5 U7 = BS170F:BS170F: DMOS FET Check availability <https://pricing.snapeda.com/parts/BS170F/Diodes%20Inc./view-part?ref=eda>; AVAILABILITY: In Stock; CHECK_PRICES: https://www.snapeda.com/parts/BS170F/Diodes+Inc./view-part/?ref=eda; DESCRIPTION: N-Channel 60 V 150µA (Ta) 330mW (Ta) Surface Mount SOT-23-3; MF: Diodes Inc.; MP: BS170F; PACKAGE: SOT-23 Multicomp; PRICE: None; SNAPEDA_LINK: https://www.snapeda.com/parts/BS170F/Diodes+Inc./view-part/?ref=snap
U6 U9 = ADS1115IDGSR:ADS1115IDGSR: Check availability <https://pricing.snapeda.com/parts/ADS1115IDGSR/Texas%20Instruments/view-part?ref=eda>; AVAILABILITY: In Stock; CHECK_PRICES: https://www.snapeda.com/parts/ADS1115IDGSR/Texas+Instruments/view-part/?ref=eda; DESCRIPTION: 16-bit, 860-SPS, 4-channel, delta-sigma ADC with PGA, oscillator, VREF, comparator and I2C; MF: Texas Instruments; MP: ADS1115IDGSR; PACKAGE: VSSOP-10 Texas Instruments; PRICE: None; PURCHASE-URL: https://www.snapeda.com/api/url_track_click_mouser/?unipart_id=45903&manufacturer=Texas Instruments&part_name=ADS1115IDGSR&search_term=ads1115; SNAPEDA_LINK: https://www.snapeda.com/parts/ADS1115IDGSR/Texas+Instruments/view-part/?ref=snap
U$1-U$3 = SN74LVC1G04DBVR:SN74LVC1G04DBVR: Check availability <https://pricing.snapeda.com/parts/SN74LVC1G04DBVR/UMW/view-part?ref=eda>; AVAILABILITY: In Stock; CHECK_PRICES: https://www.snapeda.com/parts/SN74LVC1G04DBVR/Umwelt+Sensor+Teknik/view-part/?ref=eda; DESCRIPTION: Inverter IC 1 Channel SOT-23-5; MF: UMW; MP: SN74LVC1G04DBVR; PACKAGE: None; PRICE: None; SNAPEDA_LINK: https://www.snapeda.com/parts/SN74LVC1G04DBVR/Umwelt+Sensor+Teknik/view-part/?ref=snap
U$11 = XT30UPB-M:XT30UPB-M: Check availability <https://pricing.snapeda.com/parts/XT30UPB-M/amass/view-part?ref=eda>; AVAILABILITY: Not in stock; DESCRIPTION: Socket; DC supply; XT30; male; PIN: 2; on PCBs; THT; yellow; 15A; 500V; MF: amass; MP: XT30UPB-M; PACKAGE: None; PRICE: None
X6 = microbuilder:USB_C: USB Type-C USB 2.0 Connector
Y1 = FC-135_32.7680KA-A0:FC-135_32.7680KA-A0: None Check availability <https://pricing.snapeda.com/parts/FC-135%2032.7680KA-A0/EPSON/view-part?ref=eda>; AVAILABILITY: In Stock; CHECK_PRICES: https://www.snapeda.com/parts/FC-135%2032.7680KA-A0/EPSON/view-part/?ref=eda; DESCRIPTION: 32.768 kHz ±20ppm Crystal 12.5pF 70 kOhms 2-SMD, No Lead; MF: EPSON; MP: FC-135 32.7680KA-A0; PACKAGE: SMD-2 Epson; PRICE: None; SNAPEDA_LINK: https://www.snapeda.com/parts/FC-135%2032.7680KA-A0/EPSON/view-part/?ref=snap

## Net classes
1 power: width 0.305 mm